# EAGLE schematic foxBMS_BMS-Slave_12cell (EAGLE 6.5.0), part 2 of 3
## Sheet 7 of 17: Passive Cell Balancing
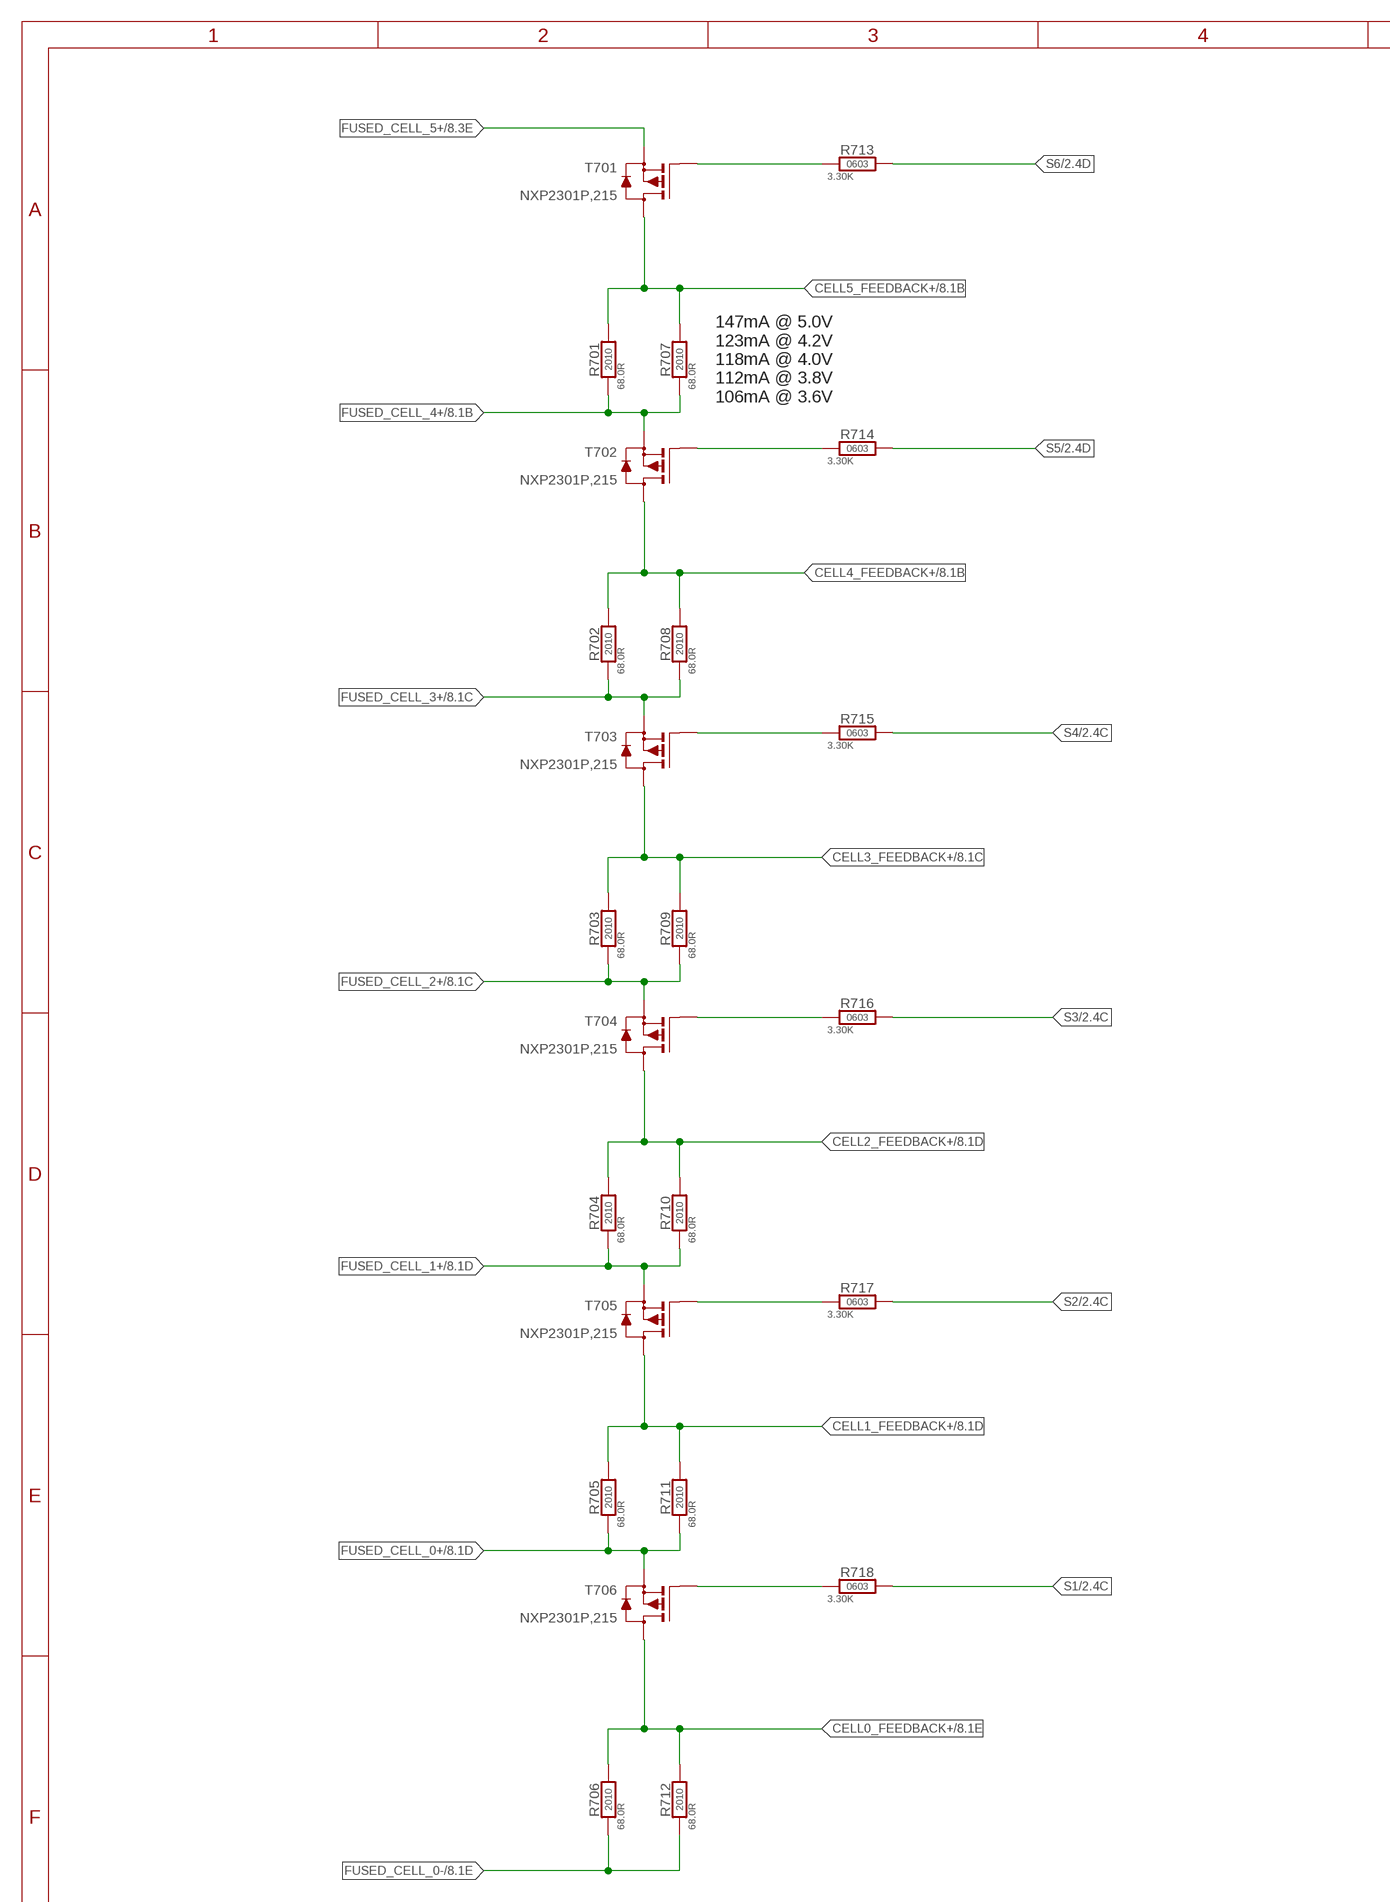
[diagram p11: schematic, sheet 7, part 1 of 2]
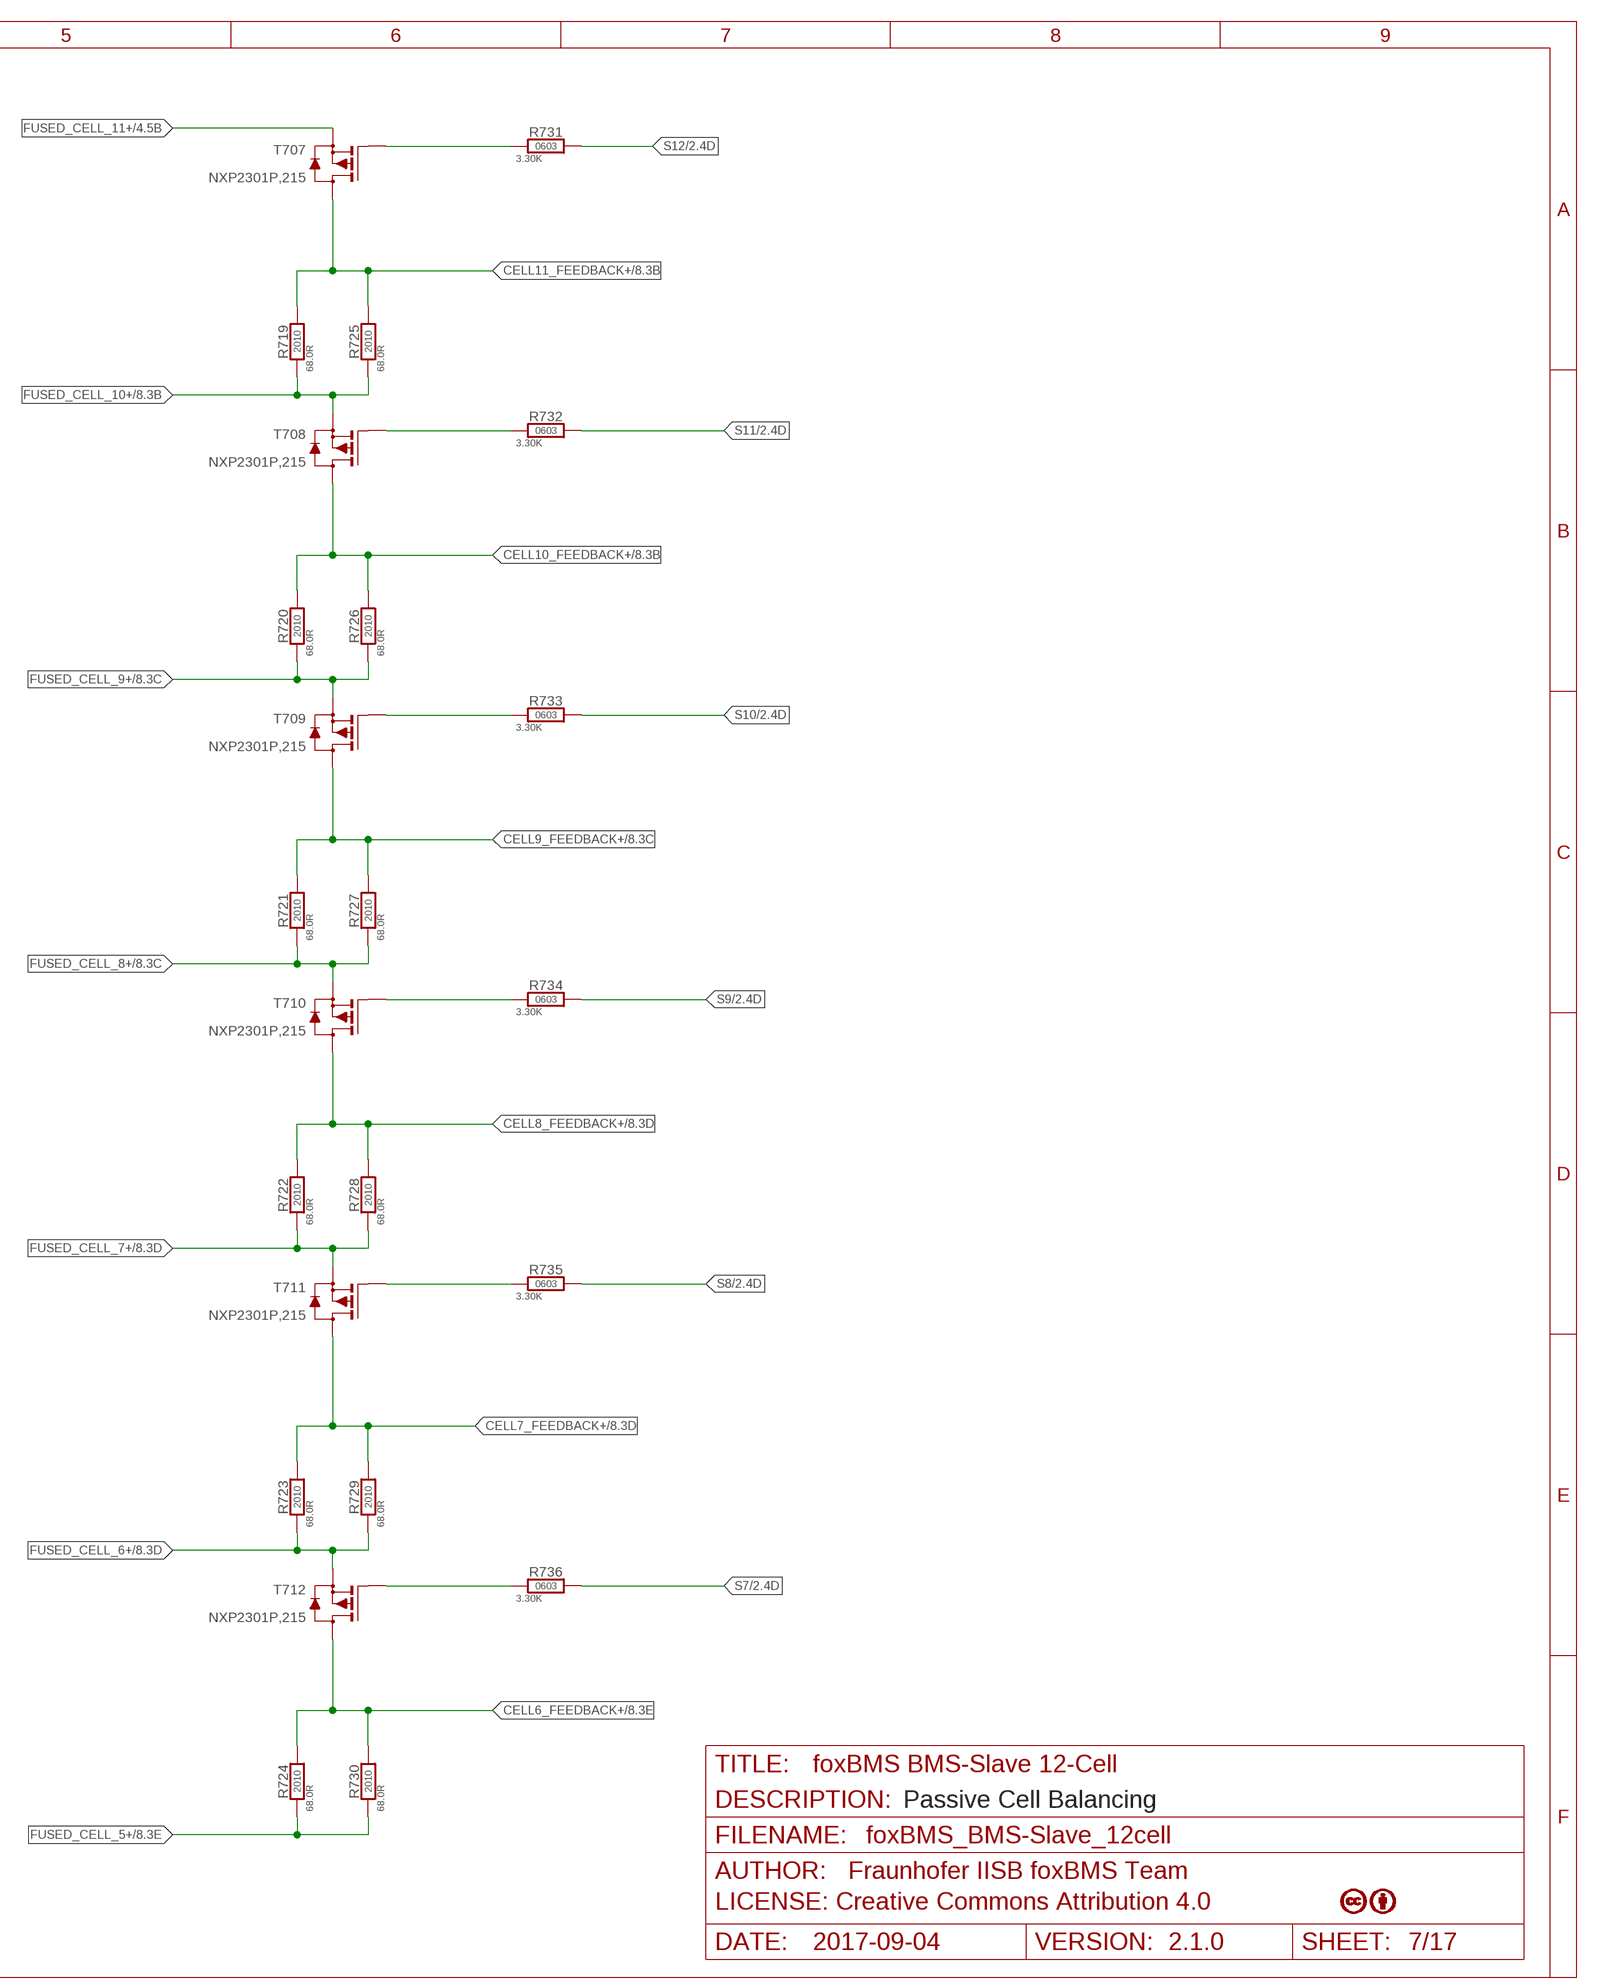
[diagram p12: schematic, sheet 7, part 2 of 2]

### Parts
R701  72R, 1%  68,0R_2010_R_YAGEO_5%_TK100_REV_01  [R_SMD_2010_R_YAGEO_REV01]  (not fitted in variant foxBMS_Debug)  (not fitted in variant foxBMS_DC-DC-only)
R702  72R, 1%  68,0R_2010_R_YAGEO_5%_TK100_REV_01  [R_SMD_2010_R_YAGEO_REV01]  (not fitted in variant foxBMS_Debug)  (not fitted in variant foxBMS_DC-DC-only)
R703  72R, 1%  68,0R_2010_R_YAGEO_5%_TK100_REV_01  [R_SMD_2010_R_YAGEO_REV01]  (not fitted in variant foxBMS_Debug)  (not fitted in variant foxBMS_DC-DC-only)
R704  72R, 1%  68,0R_2010_R_YAGEO_5%_TK100_REV_01  [R_SMD_2010_R_YAGEO_REV01]  (not fitted in variant foxBMS_Debug)  (not fitted in variant foxBMS_DC-DC-only)
R705  72R, 1%  68,0R_2010_R_YAGEO_5%_TK100_REV_01  [R_SMD_2010_R_YAGEO_REV01]  (not fitted in variant foxBMS_Debug)  (not fitted in variant foxBMS_DC-DC-only)
R706  72R, 1%  68,0R_2010_R_YAGEO_5%_TK100_REV_01  [R_SMD_2010_R_YAGEO_REV01]  (not fitted in variant foxBMS_Debug)  (not fitted in variant foxBMS_DC-DC-only)
R707  72R, 1%  68,0R_2010_R_YAGEO_5%_TK100_REV_01  [R_SMD_2010_R_YAGEO_REV01]  (not fitted in variant foxBMS_Debug)  (not fitted in variant foxBMS_DC-DC-only)
R708  72R, 1%  68,0R_2010_R_YAGEO_5%_TK100_REV_01  [R_SMD_2010_R_YAGEO_REV01]  (not fitted in variant foxBMS_Debug)  (not fitted in variant foxBMS_DC-DC-only)
R709  72R, 1%  68,0R_2010_R_YAGEO_5%_TK100_REV_01  [R_SMD_2010_R_YAGEO_REV01]  (not fitted in variant foxBMS_Debug)  (not fitted in variant foxBMS_DC-DC-only)
R710  72R, 1%  68,0R_2010_R_YAGEO_5%_TK100_REV_01  [R_SMD_2010_R_YAGEO_REV01]  (not fitted in variant foxBMS_Debug)  (not fitted in variant foxBMS_DC-DC-only)
R711  72R, 1%  68,0R_2010_R_YAGEO_5%_TK100_REV_01  [R_SMD_2010_R_YAGEO_REV01]  (not fitted in variant foxBMS_Debug)  (not fitted in variant foxBMS_DC-DC-only)
R712  72R, 1%  68,0R_2010_R_YAGEO_5%_TK100_REV_01  [R_SMD_2010_R_YAGEO_REV01]  (not fitted in variant foxBMS_Debug)  (not fitted in variant foxBMS_DC-DC-only)
R713  3.3k, 10%, 1/10W  3,30K_0603_R_VISHAY_1%_TK100_REV_01  [R_SMD_0603_R_VISHAY_REV01]  (not fitted in variant foxBMS_Debug)  (not fitted in variant foxBMS_DC-DC-only)
R714  3.3k, 10%, 1/10W  3,30K_0603_R_VISHAY_1%_TK100_REV_01  [R_SMD_0603_R_VISHAY_REV01]  (not fitted in variant foxBMS_Debug)  (not fitted in variant foxBMS_DC-DC-only)
R715  3.3k, 10%, 1/10W  3,30K_0603_R_VISHAY_1%_TK100_REV_01  [R_SMD_0603_R_VISHAY_REV01]  (not fitted in variant foxBMS_Debug)  (not fitted in variant foxBMS_DC-DC-only)
R716  3.3k, 10%, 1/10W  3,30K_0603_R_VISHAY_1%_TK100_REV_01  [R_SMD_0603_R_VISHAY_REV01]  (not fitted in variant foxBMS_Debug)  (not fitted in variant foxBMS_DC-DC-only)
R717  3.3k, 10%, 1/10W  3,30K_0603_R_VISHAY_1%_TK100_REV_01  [R_SMD_0603_R_VISHAY_REV01]  (not fitted in variant foxBMS_Debug)  (not fitted in variant foxBMS_DC-DC-only)
R718  3.3k, 10%, 1/10W  3,30K_0603_R_VISHAY_1%_TK100_REV_01  [R_SMD_0603_R_VISHAY_REV01]  (not fitted in variant foxBMS_Debug)  (not fitted in variant foxBMS_DC-DC-only)
R719  72R, 1%  68,0R_2010_R_YAGEO_5%_TK100_REV_01  [R_SMD_2010_R_YAGEO_REV01]  (not fitted in variant foxBMS_Debug)  (not fitted in variant foxBMS_DC-DC-only)
R720  72R, 1%  68,0R_2010_R_YAGEO_5%_TK100_REV_01  [R_SMD_2010_R_YAGEO_REV01]  (not fitted in variant foxBMS_Debug)  (not fitted in variant foxBMS_DC-DC-only)
R721  72R, 1%  68,0R_2010_R_YAGEO_5%_TK100_REV_01  [R_SMD_2010_R_YAGEO_REV01]  (not fitted in variant foxBMS_Debug)  (not fitted in variant foxBMS_DC-DC-only)
R722  72R, 1%  68,0R_2010_R_YAGEO_5%_TK100_REV_01  [R_SMD_2010_R_YAGEO_REV01]  (not fitted in variant foxBMS_Debug)  (not fitted in variant foxBMS_DC-DC-only)
R723  72R, 1%  68,0R_2010_R_YAGEO_5%_TK100_REV_01  [R_SMD_2010_R_YAGEO_REV01]  (not fitted in variant foxBMS_Debug)  (not fitted in variant foxBMS_DC-DC-only)
R724  72R, 1%  68,0R_2010_R_YAGEO_5%_TK100_REV_01  [R_SMD_2010_R_YAGEO_REV01]  (not fitted in variant foxBMS_Debug)  (not fitted in variant foxBMS_DC-DC-only)
R725  72R, 1%  68,0R_2010_R_YAGEO_5%_TK100_REV_01  [R_SMD_2010_R_YAGEO_REV01]  (not fitted in variant foxBMS_Debug)  (not fitted in variant foxBMS_DC-DC-only)
R726  72R, 1%  68,0R_2010_R_YAGEO_5%_TK100_REV_01  [R_SMD_2010_R_YAGEO_REV01]  (not fitted in variant foxBMS_Debug)  (not fitted in variant foxBMS_DC-DC-only)
R727  72R, 1%  68,0R_2010_R_YAGEO_5%_TK100_REV_01  [R_SMD_2010_R_YAGEO_REV01]  (not fitted in variant foxBMS_Debug)  (not fitted in variant foxBMS_DC-DC-only)
R728  72R, 1%  68,0R_2010_R_YAGEO_5%_TK100_REV_01  [R_SMD_2010_R_YAGEO_REV01]  (not fitted in variant foxBMS_Debug)  (not fitted in variant foxBMS_DC-DC-only)
R729  72R, 1%  68,0R_2010_R_YAGEO_5%_TK100_REV_01  [R_SMD_2010_R_YAGEO_REV01]  (not fitted in variant foxBMS_Debug)  (not fitted in variant foxBMS_DC-DC-only)
R730  72R, 1%  68,0R_2010_R_YAGEO_5%_TK100_REV_01  [R_SMD_2010_R_YAGEO_REV01]  (not fitted in variant foxBMS_Debug)  (not fitted in variant foxBMS_DC-DC-only)
R731  3.3k, 10%, 1/10W  3,30K_0603_R_VISHAY_1%_TK100_REV_01  [R_SMD_0603_R_VISHAY_REV01]  (not fitted in variant foxBMS_Debug)  (not fitted in variant foxBMS_DC-DC-only)
R732  3.3k, 10%, 1/10W  3,30K_0603_R_VISHAY_1%_TK100_REV_01  [R_SMD_0603_R_VISHAY_REV01]  (not fitted in variant foxBMS_Debug)  (not fitted in variant foxBMS_DC-DC-only)
R733  3.3k, 10%, 1/10W  3,30K_0603_R_VISHAY_1%_TK100_REV_01  [R_SMD_0603_R_VISHAY_REV01]  (not fitted in variant foxBMS_Debug)  (not fitted in variant foxBMS_DC-DC-only)
R734  3.3k, 10%, 1/10W  3,30K_0603_R_VISHAY_1%_TK100_REV_01  [R_SMD_0603_R_VISHAY_REV01]  (not fitted in variant foxBMS_Debug)  (not fitted in variant foxBMS_DC-DC-only)
R735  3.3k, 10%, 1/10W  3,30K_0603_R_VISHAY_1%_TK100_REV_01  [R_SMD_0603_R_VISHAY_REV01]  (not fitted in variant foxBMS_Debug)  (not fitted in variant foxBMS_DC-DC-only)
R736  3.3k, 10%, 1/10W  3,30K_0603_R_VISHAY_1%_TK100_REV_01  [R_SMD_0603_R_VISHAY_REV01]  (not fitted in variant foxBMS_Debug)  (not fitted in variant foxBMS_DC-DC-only)
T701  NX2301P  NX2301P,215  [D_SMD_SOT23_(TO-236AB)_R_NXP_REV01]  (not fitted in variant foxBMS_Debug)  (not fitted in variant foxBMS_DC-DC-only)
T702  NX2301P  NX2301P,215  [D_SMD_SOT23_(TO-236AB)_R_NXP_REV01]  (not fitted in variant foxBMS_Debug)  (not fitted in variant foxBMS_DC-DC-only)
T703  NX2301P  NX2301P,215  [D_SMD_SOT23_(TO-236AB)_R_NXP_REV01]  (not fitted in variant foxBMS_Debug)  (not fitted in variant foxBMS_DC-DC-only)
T704  NX2301P  NX2301P,215  [D_SMD_SOT23_(TO-236AB)_R_NXP_REV01]  (not fitted in variant foxBMS_Debug)  (not fitted in variant foxBMS_DC-DC-only)
T705  NX2301P  NX2301P,215  [D_SMD_SOT23_(TO-236AB)_R_NXP_REV01]  (not fitted in variant foxBMS_Debug)  (not fitted in variant foxBMS_DC-DC-only)
T706  NX2301P  NX2301P,215  [D_SMD_SOT23_(TO-236AB)_R_NXP_REV01]  (not fitted in variant foxBMS_Debug)  (not fitted in variant foxBMS_DC-DC-only)
T707  NX2301P  NX2301P,215  [D_SMD_SOT23_(TO-236AB)_R_NXP_REV01]  (not fitted in variant foxBMS_Debug)  (not fitted in variant foxBMS_DC-DC-only)
T708  NX2301P  NX2301P,215  [D_SMD_SOT23_(TO-236AB)_R_NXP_REV01]  (not fitted in variant foxBMS_Debug)  (not fitted in variant foxBMS_DC-DC-only)
T709  NX2301P  NX2301P,215  [D_SMD_SOT23_(TO-236AB)_R_NXP_REV01]  (not fitted in variant foxBMS_Debug)  (not fitted in variant foxBMS_DC-DC-only)
T710  NX2301P  NX2301P,215  [D_SMD_SOT23_(TO-236AB)_R_NXP_REV01]  (not fitted in variant foxBMS_Debug)  (not fitted in variant foxBMS_DC-DC-only)
T711  NX2301P  NX2301P,215  [D_SMD_SOT23_(TO-236AB)_R_NXP_REV01]  (not fitted in variant foxBMS_Debug)  (not fitted in variant foxBMS_DC-DC-only)
T712  NX2301P  NX2301P,215  [D_SMD_SOT23_(TO-236AB)_R_NXP_REV01]  (not fitted in variant foxBMS_Debug)  (not fitted in variant foxBMS_DC-DC-only)

### Nets
CELL0_FEEDBACK+: R706.P$2 R712.P$2 T706.3(D) ; also sheet 8
CELL1_FEEDBACK+: R705.P$2 R711.P$2 T705.3(D) ; also sheet 8
CELL2_FEEDBACK+: R704.P$2 R710.P$2 T704.3(D) ; also sheet 8
CELL3_FEEDBACK+: R703.P$2 R709.P$2 T703.3(D) ; also sheet 8
CELL4_FEEDBACK+: R702.P$2 R708.P$2 T702.3(D) ; also sheet 8
CELL5_FEEDBACK+: R701.P$2 R707.P$2 T701.3(D) ; also sheet 8
CELL6_FEEDBACK+: R724.P$2 R730.P$2 T712.3(D) ; also sheet 8
CELL7_FEEDBACK+: R723.P$2 R729.P$2 T711.3(D) ; also sheet 8
CELL8_FEEDBACK+: R722.P$2 R728.P$2 T710.3(D) ; also sheet 8
CELL9_FEEDBACK+: R721.P$2 R727.P$2 T709.3(D) ; also sheet 8
CELL10_FEEDBACK+: R720.P$2 R726.P$2 T708.3(D) ; also sheet 8
CELL11_FEEDBACK+: R719.P$2 R725.P$2 T707.3(D) ; also sheet 8
FUSED_CELL_0+: R705.P$1 R711.P$1 T706.2(S) ; also sheet 4,5,6,8
FUSED_CELL_0-: R706.P$1 R712.P$1 ; also sheet 4,5,6,8
FUSED_CELL_1+: R704.P$1 R710.P$1 T705.2(S) ; also sheet 4,5,6,8
FUSED_CELL_2+: R703.P$1 R709.P$1 T704.2(S) ; also sheet 4,5,6,8
FUSED_CELL_3+: R702.P$1 R708.P$1 T703.2(S) ; also sheet 4,5,6,8
FUSED_CELL_4+: R701.P$1 R707.P$1 T702.2(S) ; also sheet 4,5,6,8
FUSED_CELL_5+: R724.P$1 R730.P$1 T701.2(S) ; also sheet 4,5,6,8
FUSED_CELL_6+: R723.P$1 R729.P$1 T712.2(S) ; also sheet 4,5,6,8
FUSED_CELL_7+: R722.P$1 R728.P$1 T711.2(S) ; also sheet 4,5,6,8
FUSED_CELL_8+: R721.P$1 R727.P$1 T710.2(S) ; also sheet 4,5,6,8
FUSED_CELL_9+: R720.P$1 R726.P$1 T709.2(S) ; also sheet 4,5,6,8
FUSED_CELL_10+: R719.P$1 R725.P$1 T708.2(S) ; also sheet 4,5,6,8
FUSED_CELL_11+: T707.2(S) ; also sheet 4,5,6
N$32: R718.1 T706.1(G)
N$49: R717.1 T705.1(G)
N$51: R716.1 T704.1(G)
N$54: R715.1 T703.1(G)
N$57: R714.1 T702.1(G)
N$60: R713.1 T701.1(G)
N$63: R736.1 T712.1(G)
N$69: R735.1 T711.1(G)
N$72: R734.1 T710.1(G)
N$75: R733.1 T709.1(G)
N$78: R732.1 T708.1(G)
N$81: R731.1 T707.1(G)
S1: R718.2 ; also sheet 2
S2: R717.2 ; also sheet 2
S3: R716.2 ; also sheet 2
S4: R715.2 ; also sheet 2
S5: R714.2 ; also sheet 2
S6: R713.2 ; also sheet 2
S7: R736.2 ; also sheet 2
S8: R735.2 ; also sheet 2
S9: R734.2 ; also sheet 2
S10: R733.2 ; also sheet 2
S11: R732.2 ; also sheet 2
S12: R731.2 ; also sheet 2

### Notes on the sheet
- 147mA @ 5.0V
  123mA @ 4.2V
  118mA @ 4.0V
  112mA @ 3.8V
  106mA @ 3.6V
- Passive Cell Balancing

## Sheet 8 of 17: Passive Balacing Feedback
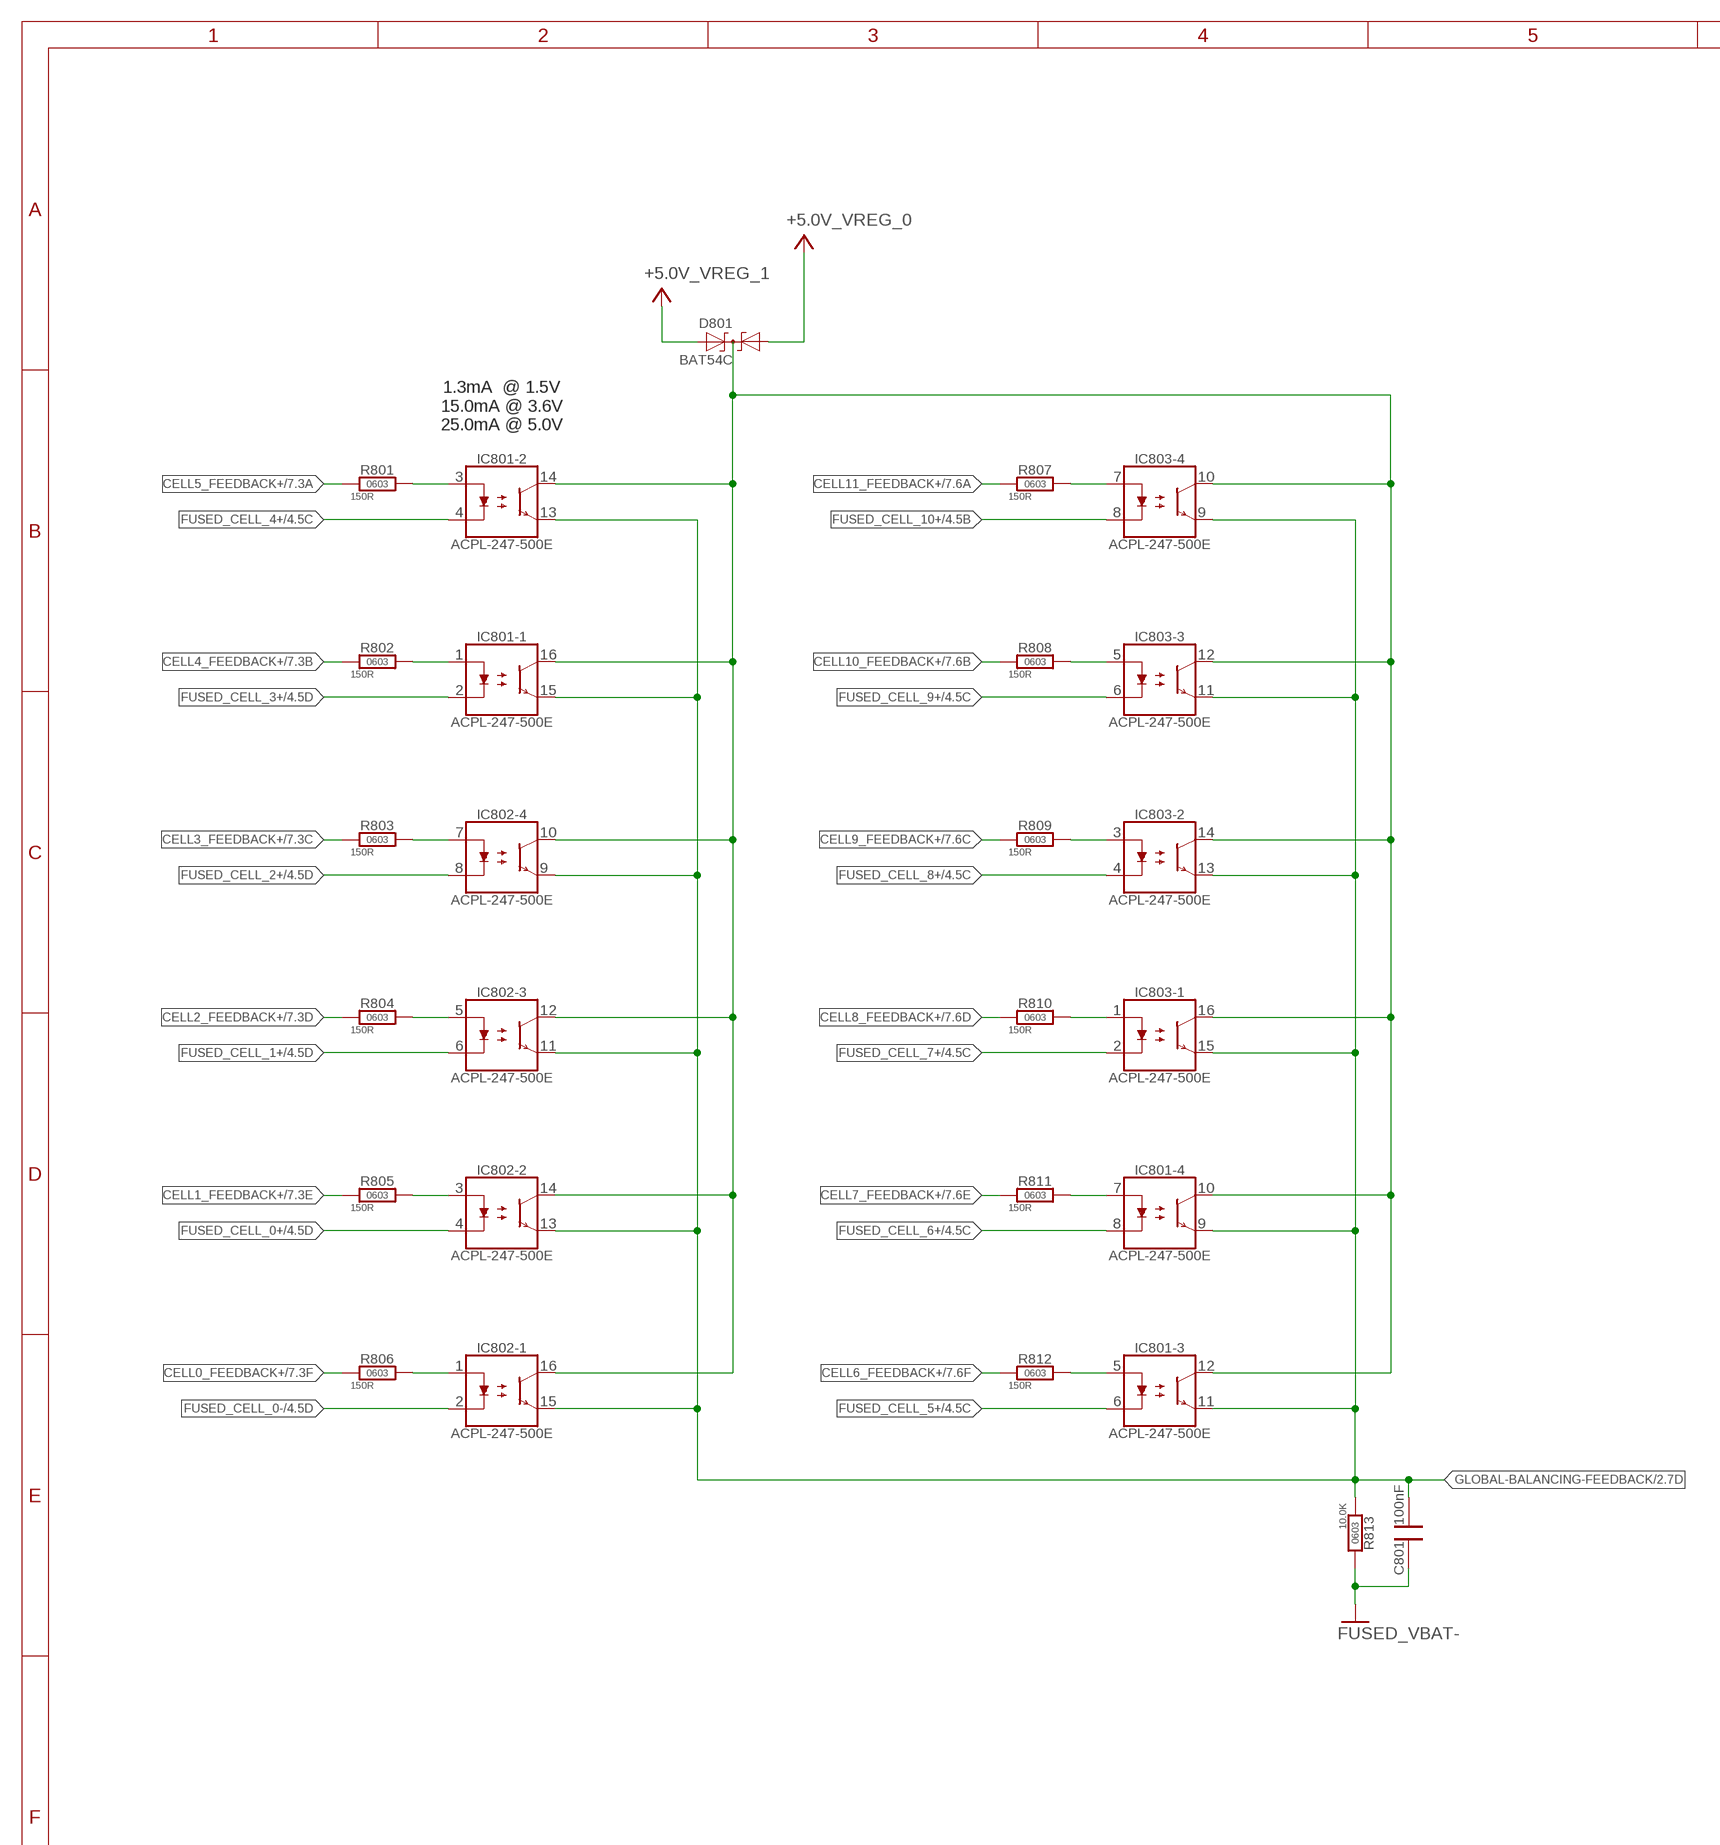
[diagram p13: schematic, sheet 8, part 1 of 2]
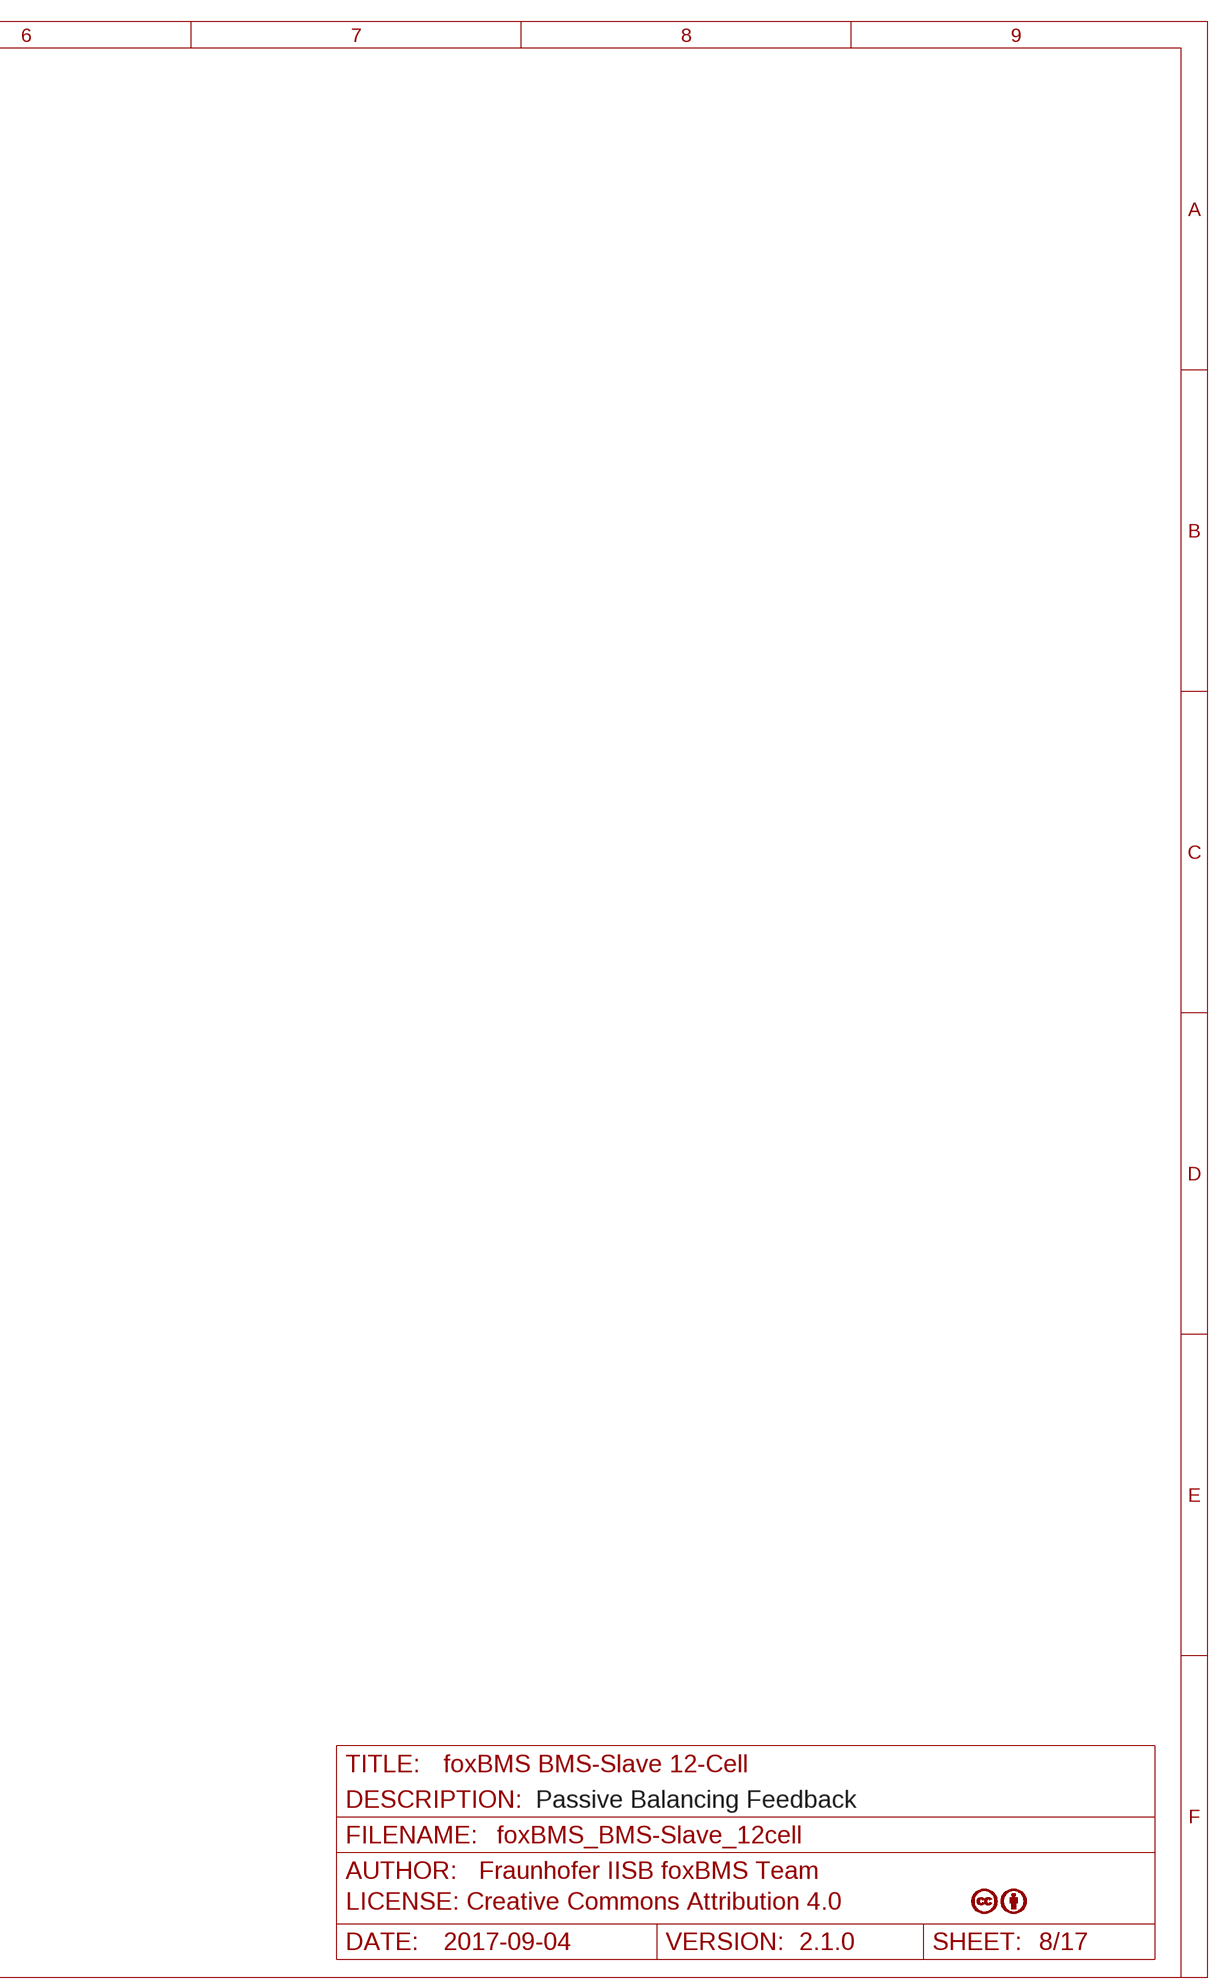
[diagram p14: schematic, sheet 8, part 2 of 2]

### Parts
C801  100nF, 20%, 16V  100NF_0603_16V_X7R_KEMET  [C_SMD_0603_(1608)_R_KEMET_REV01]  (not fitted in variant foxBMS_Debug)  (not fitted in variant foxBMS_DC-DC-only)
D801  BAT54C  [D_SMD_SOT23_(TO-236AB)_R_NXP_REV01]  (not fitted in variant foxBMS_Debug)  (not fitted in variant foxBMS_DC-DC-only)
IC801  ACPL-247-500E  [OC_SMD_SOIC-16_R_AVAGO_REV01]  (not fitted in variant foxBMS_Debug)  (not fitted in variant foxBMS_DC-DC-only)
IC802  ACPL-247-500E  [OC_SMD_SOIC-16_R_AVAGO_REV01]  (not fitted in variant foxBMS_Debug)  (not fitted in variant foxBMS_DC-DC-only)
IC803  ACPL-247-500E  [OC_SMD_SOIC-16_R_AVAGO_REV01]  (not fitted in variant foxBMS_Debug)  (not fitted in variant foxBMS_DC-DC-only)
R801  150R_0603_R_VISHAY_1%_TK100_REV_01  [R_SMD_0603_R_VISHAY_REV01]  (not fitted in variant foxBMS_Debug)  (not fitted in variant foxBMS_DC-DC-only)
R802  150R_0603_R_VISHAY_1%_TK100_REV_01  [R_SMD_0603_R_VISHAY_REV01]  (not fitted in variant foxBMS_Debug)  (not fitted in variant foxBMS_DC-DC-only)
R803  150R_0603_R_VISHAY_1%_TK100_REV_01  [R_SMD_0603_R_VISHAY_REV01]  (not fitted in variant foxBMS_Debug)  (not fitted in variant foxBMS_DC-DC-only)
R804  150R_0603_R_VISHAY_1%_TK100_REV_01  [R_SMD_0603_R_VISHAY_REV01]  (not fitted in variant foxBMS_Debug)  (not fitted in variant foxBMS_DC-DC-only)
R805  150R_0603_R_VISHAY_1%_TK100_REV_01  [R_SMD_0603_R_VISHAY_REV01]  (not fitted in variant foxBMS_Debug)  (not fitted in variant foxBMS_DC-DC-only)
R806  150R_0603_R_VISHAY_1%_TK100_REV_01  [R_SMD_0603_R_VISHAY_REV01]  (not fitted in variant foxBMS_Debug)  (not fitted in variant foxBMS_DC-DC-only)
R807  150R_0603_R_VISHAY_1%_TK100_REV_01  [R_SMD_0603_R_VISHAY_REV01]  (not fitted in variant foxBMS_Debug)  (not fitted in variant foxBMS_DC-DC-only)
R808  150R_0603_R_VISHAY_1%_TK100_REV_01  [R_SMD_0603_R_VISHAY_REV01]  (not fitted in variant foxBMS_Debug)  (not fitted in variant foxBMS_DC-DC-only)
R809  150R_0603_R_VISHAY_1%_TK100_REV_01  [R_SMD_0603_R_VISHAY_REV01]  (not fitted in variant foxBMS_Debug)  (not fitted in variant foxBMS_DC-DC-only)
R810  150R_0603_R_VISHAY_1%_TK100_REV_01  [R_SMD_0603_R_VISHAY_REV01]  (not fitted in variant foxBMS_Debug)  (not fitted in variant foxBMS_DC-DC-only)
R811  150R_0603_R_VISHAY_1%_TK100_REV_01  [R_SMD_0603_R_VISHAY_REV01]  (not fitted in variant foxBMS_Debug)  (not fitted in variant foxBMS_DC-DC-only)
R812  150R_0603_R_VISHAY_1%_TK100_REV_01  [R_SMD_0603_R_VISHAY_REV01]  (not fitted in variant foxBMS_Debug)  (not fitted in variant foxBMS_DC-DC-only)
R813  10,0K_0603_R_VISHAY_1%_TK100_REV_01  [R_SMD_0603_R_VISHAY_REV01]  (not fitted in variant foxBMS_Debug)  (not fitted in variant foxBMS_DC-DC-only)

### Nets
+5.0V_VREG_0: D801.2(A2) ; also sheet 2,9,11,13,15
+5.0V_VREG_1: D801.1(A1) ; also sheet 3,10,12,14,15
CELL0_FEEDBACK+: R806.1 ; also sheet 7
CELL1_FEEDBACK+: R805.1 ; also sheet 7
CELL2_FEEDBACK+: R804.1 ; also sheet 7
CELL3_FEEDBACK+: R803.1 ; also sheet 7
CELL4_FEEDBACK+: R802.1 ; also sheet 7
CELL5_FEEDBACK+: R801.1 ; also sheet 7
CELL6_FEEDBACK+: R812.1 ; also sheet 7
CELL7_FEEDBACK+: R811.1 ; also sheet 7
CELL8_FEEDBACK+: R810.1 ; also sheet 7
CELL9_FEEDBACK+: R809.1 ; also sheet 7
CELL10_FEEDBACK+: R808.1 ; also sheet 7
CELL11_FEEDBACK+: R807.1 ; also sheet 7
FUSED_CELL_0+: IC802.4(-2:K) ; also sheet 4,5,6,7
FUSED_CELL_0-: IC802.2(-1:K) ; also sheet 4,5,6,7
FUSED_CELL_1+: IC802.6(-3:K) ; also sheet 4,5,6,7
FUSED_CELL_2+: IC802.8(-4:K) ; also sheet 4,5,6,7
FUSED_CELL_3+: IC801.2(-1:K) ; also sheet 4,5,6,7
FUSED_CELL_4+: IC801.4(-2:K) ; also sheet 4,5,6,7
FUSED_CELL_5+: IC801.6(-3:K) ; also sheet 4,5,6,7
FUSED_CELL_6+: IC801.8(-4:K) ; also sheet 4,5,6,7
FUSED_CELL_7+: IC803.2(-1:K) ; also sheet 4,5,6,7
FUSED_CELL_8+: IC803.4(-2:K) ; also sheet 4,5,6,7
FUSED_CELL_9+: IC803.6(-3:K) ; also sheet 4,5,6,7
FUSED_CELL_10+: IC803.8(-4:K) ; also sheet 4,5,6,7
FUSED_VBAT-: C801.1 R813.2 ; also sheet 2,3,4,5,6,9,10,11,12,13,14,15,16
GLOBAL-BALANCING-FEEDBACK: C801.2 IC801.9(-4:V_EMITTER) IC801.11(-3:V_EMITTER) IC801.13(-2:V_EMITTER) IC801.15(-1:V_EMITTER) IC802.9(-4:V_EMITTER) IC802.11(-3:V_EMITTER) IC802.13(-2:V_EMITTER) IC802.15(-1:V_EMITTER) IC803.9(-4:V_EMITTER) IC803.11(-3:V_EMITTER) IC803.13(-2:V_EMITTER) IC803.15(-1:V_EMITTER) R813.1 ; also sheet 2,3
N$39: D801.3(C) IC801.10(-4:V_COLLECTOR) IC801.12(-3:V_COLLECTOR) IC801.14(-2:V_COLLECTOR) IC801.16(-1:V_COLLECTOR) IC802.10(-4:V_COLLECTOR) IC802.12(-3:V_COLLECTOR) IC802.14(-2:V_COLLECTOR) IC802.16(-1:V_COLLECTOR) IC803.10(-4:V_COLLECTOR) IC803.12(-3:V_COLLECTOR) IC803.14(-2:V_COLLECTOR) IC803.16(-1:V_COLLECTOR)
N$52: IC801.1(-1:A) R802.2
N$55: IC802.7(-4:A) R803.2
N$58: IC802.5(-3:A) R804.2
N$61: IC803.5(-3:A) R808.2
N$64: IC803.3(-2:A) R809.2
N$70: IC802.3(-2:A) R805.2
N$73: IC803.7(-4:A) R807.2
N$83: IC803.1(-1:A) R810.2
N$85: IC801.7(-4:A) R811.2
N$88: IC802.1(-1:A) R806.2
N$90: IC801.5(-3:A) R812.2
N$93: IC801.3(-2:A) R801.2

### Notes on the sheet
- 1.3mA  @ 1.5V
  15.0mA @ 3.6V
  25.0mA @ 5.0V
- Passive Balancing Feedback

## Sheet 9 of 17: Primary Analog Inputs
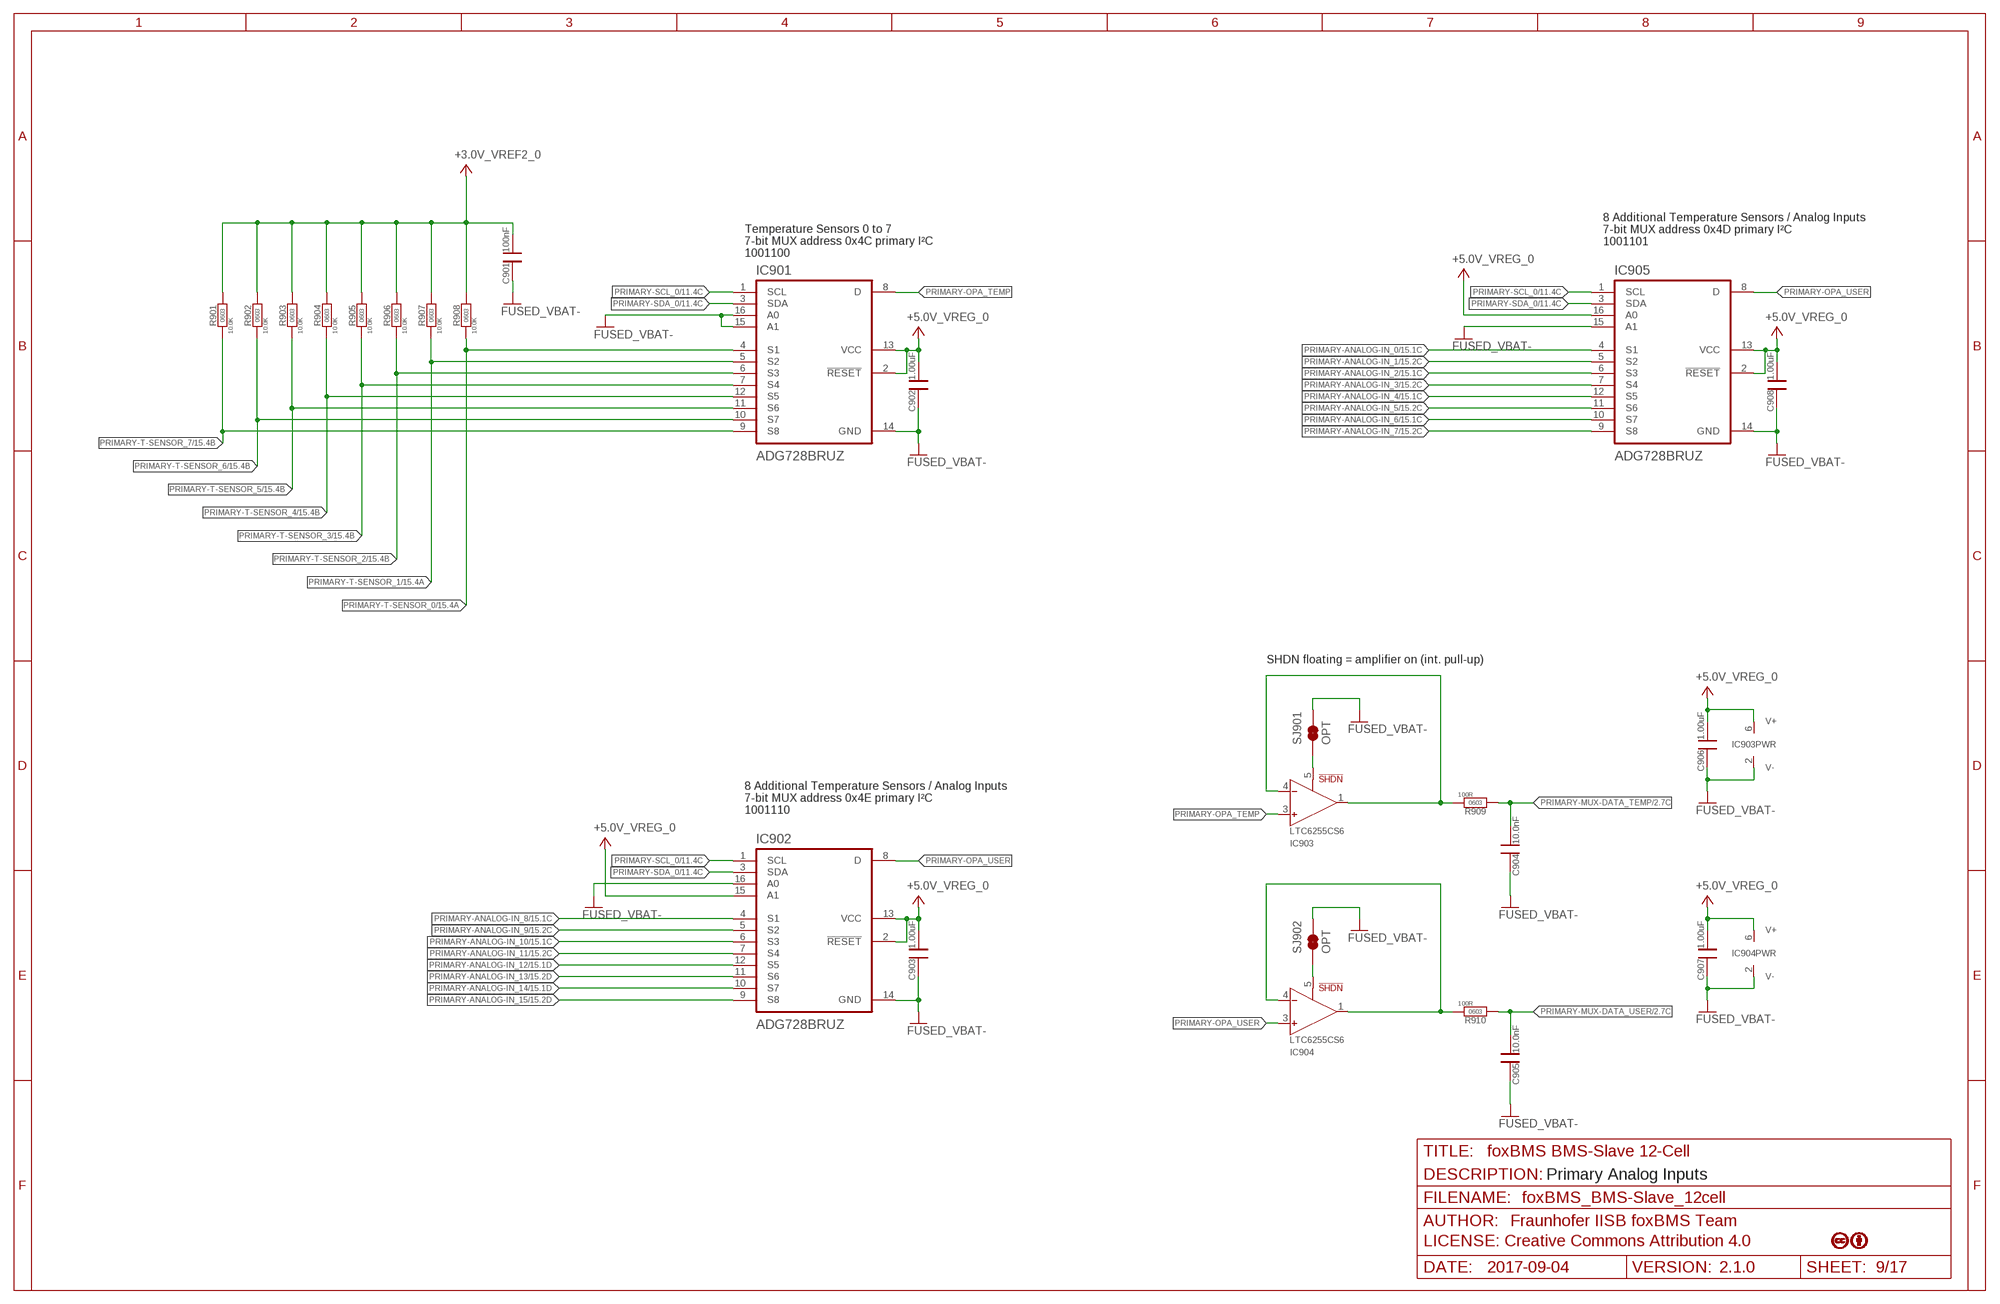
[diagram p15: schematic, sheet 9]

### Parts
C901  100nF, 20%, 16V  100NF_0603_16V_X7R_KEMET  [C_SMD_0603_(1608)_R_KEMET_REV01]  (not fitted in variant foxBMS_Debug)  (not fitted in variant foxBMS_DC-DC-only)
C902  1uF, 20%, 16V  1,00µF_0603_16V_X7R_KEMET  [C_SMD_0603_(1608)_R_KEMET_REV01]  (not fitted in variant foxBMS_Debug)  (not fitted in variant foxBMS_DC-DC-only)
C903  1uF, 20%, 16V  1,00µF_0603_16V_X7R_KEMET  [C_SMD_0603_(1608)_R_KEMET_REV01]  (not fitted in variant foxBMS_Debug)  (not fitted in variant foxBMS_DC-DC-only)
C904  10nF, 100V, 10%  10,0NF_0603__100V_X7R_KEMET  [C_SMD_0603_(1608)_R_KEMET_REV01]  (not fitted in variant foxBMS_Debug)  (not fitted in variant foxBMS_DC-DC-only)
C905  10nF, 100V, 10%  10,0NF_0603__100V_X7R_KEMET  [C_SMD_0603_(1608)_R_KEMET_REV01]  (not fitted in variant foxBMS_Debug)  (not fitted in variant foxBMS_DC-DC-only)
C906  1uF, 20%, 16V  1,00µF_0603_16V_X7R_KEMET  [C_SMD_0603_(1608)_R_KEMET_REV01]  (not fitted in variant foxBMS_Debug)  (not fitted in variant foxBMS_DC-DC-only)
C907  1uF, 20%, 16V  1,00µF_0603_16V_X7R_KEMET  [C_SMD_0603_(1608)_R_KEMET_REV01]  (not fitted in variant foxBMS_Debug)  (not fitted in variant foxBMS_DC-DC-only)
C908  1uF, 20%, 16V  1,00µF_0603_16V_X7R_KEMET  [C_SMD_0603_(1608)_R_KEMET_REV01]  (not fitted in variant foxBMS_Debug)  (not fitted in variant foxBMS_DC-DC-only)
IC901  ADG728BRUZ  [SOP65P638X110-16N]  (not fitted in variant foxBMS_Debug)  (not fitted in variant foxBMS_DC-DC-only)
IC902  ADG728BRUZ  [SOP65P638X110-16N]  (not fitted in variant foxBMS_Debug)  (not fitted in variant foxBMS_DC-DC-only)
IC903  LTC6255CS6  [IC_SMD_TSOT-23-6_(S6)_R_LINEAR_REV01]  (not fitted in variant foxBMS_Debug)  (not fitted in variant foxBMS_DC-DC-only)
IC904  LTC6255CS6  [IC_SMD_TSOT-23-6_(S6)_R_LINEAR_REV01]  (not fitted in variant foxBMS_Debug)  (not fitted in variant foxBMS_DC-DC-only)
IC905  ADG728BRUZ  [SOP65P638X110-16N]  (not fitted in variant foxBMS_Debug)  (not fitted in variant foxBMS_DC-DC-only)
R901  10,0K_0603_R_VISHAY_1%_TK100_REV_01  [R_SMD_0603_R_VISHAY_REV01]  (not fitted in variant foxBMS_Debug)  (not fitted in variant foxBMS_DC-DC-only)
R902  10,0K_0603_R_VISHAY_1%_TK100_REV_01  [R_SMD_0603_R_VISHAY_REV01]  (not fitted in variant foxBMS_Debug)  (not fitted in variant foxBMS_DC-DC-only)
R903  10,0K_0603_R_VISHAY_1%_TK100_REV_01  [R_SMD_0603_R_VISHAY_REV01]  (not fitted in variant foxBMS_Debug)  (not fitted in variant foxBMS_DC-DC-only)
R904  10,0K_0603_R_VISHAY_1%_TK100_REV_01  [R_SMD_0603_R_VISHAY_REV01]  (not fitted in variant foxBMS_Debug)  (not fitted in variant foxBMS_DC-DC-only)
R905  10,0K_0603_R_VISHAY_1%_TK100_REV_01  [R_SMD_0603_R_VISHAY_REV01]  (not fitted in variant foxBMS_Debug)  (not fitted in variant foxBMS_DC-DC-only)
R906  10,0K_0603_R_VISHAY_1%_TK100_REV_01  [R_SMD_0603_R_VISHAY_REV01]  (not fitted in variant foxBMS_Debug)  (not fitted in variant foxBMS_DC-DC-only)
R907  10,0K_0603_R_VISHAY_1%_TK100_REV_01  [R_SMD_0603_R_VISHAY_REV01]  (not fitted in variant foxBMS_Debug)  (not fitted in variant foxBMS_DC-DC-only)
R908  10,0K_0603_R_VISHAY_1%_TK100_REV_01  [R_SMD_0603_R_VISHAY_REV01]  (not fitted in variant foxBMS_Debug)  (not fitted in variant foxBMS_DC-DC-only)
R909  100R_0603_R_VISHAY_1%_TK100_REV_01  [R_SMD_0603_R_VISHAY_REV01]  (not fitted in variant foxBMS_Debug)  (not fitted in variant foxBMS_DC-DC-only)
R910  100R_0603_R_VISHAY_1%_TK100_REV_01  [R_SMD_0603_R_VISHAY_REV01]  (not fitted in variant foxBMS_Debug)  (not fitted in variant foxBMS_DC-DC-only)
SJ901  OPT  CUSTOM_JUMPER_SJ  [CUSTOM_JUMPER_SJ]  (not fitted in variant foxBMS_Debug)  (not fitted in variant foxBMS_DC-DC-only)
SJ902  OPT  CUSTOM_JUMPER_SJ  [CUSTOM_JUMPER_SJ]  (not fitted in variant foxBMS_Debug)  (not fitted in variant foxBMS_DC-DC-only)

### Nets
+3.0V_VREF2_0: C901.2 R901.2 R902.2 R903.2 R904.2 R905.2 R906.2 R907.2 R908.2 ; also sheet 2,15
+5.0V_VREG_0: C902.2 C903.2 C906.2 C907.2 C908.2 IC901.2(!RESET) IC901.13(VCC) IC902.2(!RESET) IC902.13(VCC) IC902.15(A1) IC903.6(V+) IC904.6(V+) IC905.2(!RESET) IC905.13(VCC) IC905.16(A0) ; also sheet 2,8,11,13,15
FUSED_VBAT-: C901.1 C902.1 C903.1 C904.1 C905.1 C906.1 C907.1 C908.1 IC901.14(GND) IC901.15(A1) IC901.16(A0) IC902.14(GND) IC902.16(A0) IC903.2(V-) IC904.2(V-) IC905.14(GND) IC905.15(A1) SJ901.2 SJ902.2 ; also sheet 2,3,4,5,6,8,10,11,12,13,14,15,16
N$1: IC904.1(VOUT) IC904.4(-) R910.1
N$2: IC904.5(!SHDN) SJ902.1
N$6: IC903.1(VOUT) IC903.4(-) R909.1
N$16: IC903.5(!SHDN) SJ901.1
PRIMARY-ANALOG-IN_0: IC905.4(S1) ; also sheet 15
PRIMARY-ANALOG-IN_1: IC905.5(S2) ; also sheet 15
PRIMARY-ANALOG-IN_2: IC905.6(S3) ; also sheet 15
PRIMARY-ANALOG-IN_3: IC905.7(S4) ; also sheet 15
PRIMARY-ANALOG-IN_4: IC905.12(S5) ; also sheet 15
PRIMARY-ANALOG-IN_5: IC905.11(S6) ; also sheet 15
PRIMARY-ANALOG-IN_6: IC905.10(S7) ; also sheet 15
PRIMARY-ANALOG-IN_7: IC905.9(S8) ; also sheet 15
PRIMARY-ANALOG-IN_8: IC902.4(S1) ; also sheet 15
PRIMARY-ANALOG-IN_9: IC902.5(S2) ; also sheet 15
PRIMARY-ANALOG-IN_10: IC902.6(S3) ; also sheet 15
PRIMARY-ANALOG-IN_11: IC902.7(S4) ; also sheet 15
PRIMARY-ANALOG-IN_12: IC902.12(S5) ; also sheet 15
PRIMARY-ANALOG-IN_13: IC902.11(S6) ; also sheet 15
PRIMARY-ANALOG-IN_14: IC902.10(S7) ; also sheet 15
PRIMARY-ANALOG-IN_15: IC902.9(S8) ; also sheet 15
PRIMARY-MUX-DATA_TEMP: C904.2 R909.2 ; also sheet 2
PRIMARY-MUX-DATA_USER: C905.2 R910.2 ; also sheet 2
PRIMARY-OPA_TEMP: IC901.8(D) IC903.3(+)
PRIMARY-OPA_USER: IC902.8(D) IC904.3(+) IC905.8(D)
PRIMARY-SCL_0: IC901.1(SCL) IC902.1(SCL) IC905.1(SCL) ; also sheet 2,11,13
PRIMARY-SDA_0: IC901.3(SDA) IC902.3(SDA) IC905.3(SDA) ; also sheet 2,11,13
PRIMARY-T-SENSOR_0: IC901.4(S1) R908.1 ; also sheet 15
PRIMARY-T-SENSOR_1: IC901.5(S2) R907.1 ; also sheet 15
PRIMARY-T-SENSOR_2: IC901.6(S3) R906.1 ; also sheet 15
PRIMARY-T-SENSOR_3: IC901.7(S4) R905.1 ; also sheet 15
PRIMARY-T-SENSOR_4: IC901.12(S5) R904.1 ; also sheet 15
PRIMARY-T-SENSOR_5: IC901.11(S6) R903.1 ; also sheet 15
PRIMARY-T-SENSOR_6: IC901.10(S7) R902.1 ; also sheet 15
PRIMARY-T-SENSOR_7: IC901.9(S8) R901.1 ; also sheet 15

### Notes on the sheet
- 8 Additional Temperature Sensors / Analog Inputs
  7-bit MUX address 0x4D primary I²C
  1001101
- Temperature Sensors 0 to 7
  7-bit MUX address 0x4C primary I²C
  1001100
- SHDN floating = amplifier on (int. pull-up)
- 8 Additional Temperature Sensors / Analog Inputs
  7-bit MUX address 0x4E primary I²C
  1001110
- Primary Analog Inputs

## Sheet 10 of 17: Secondary Analog Inputs
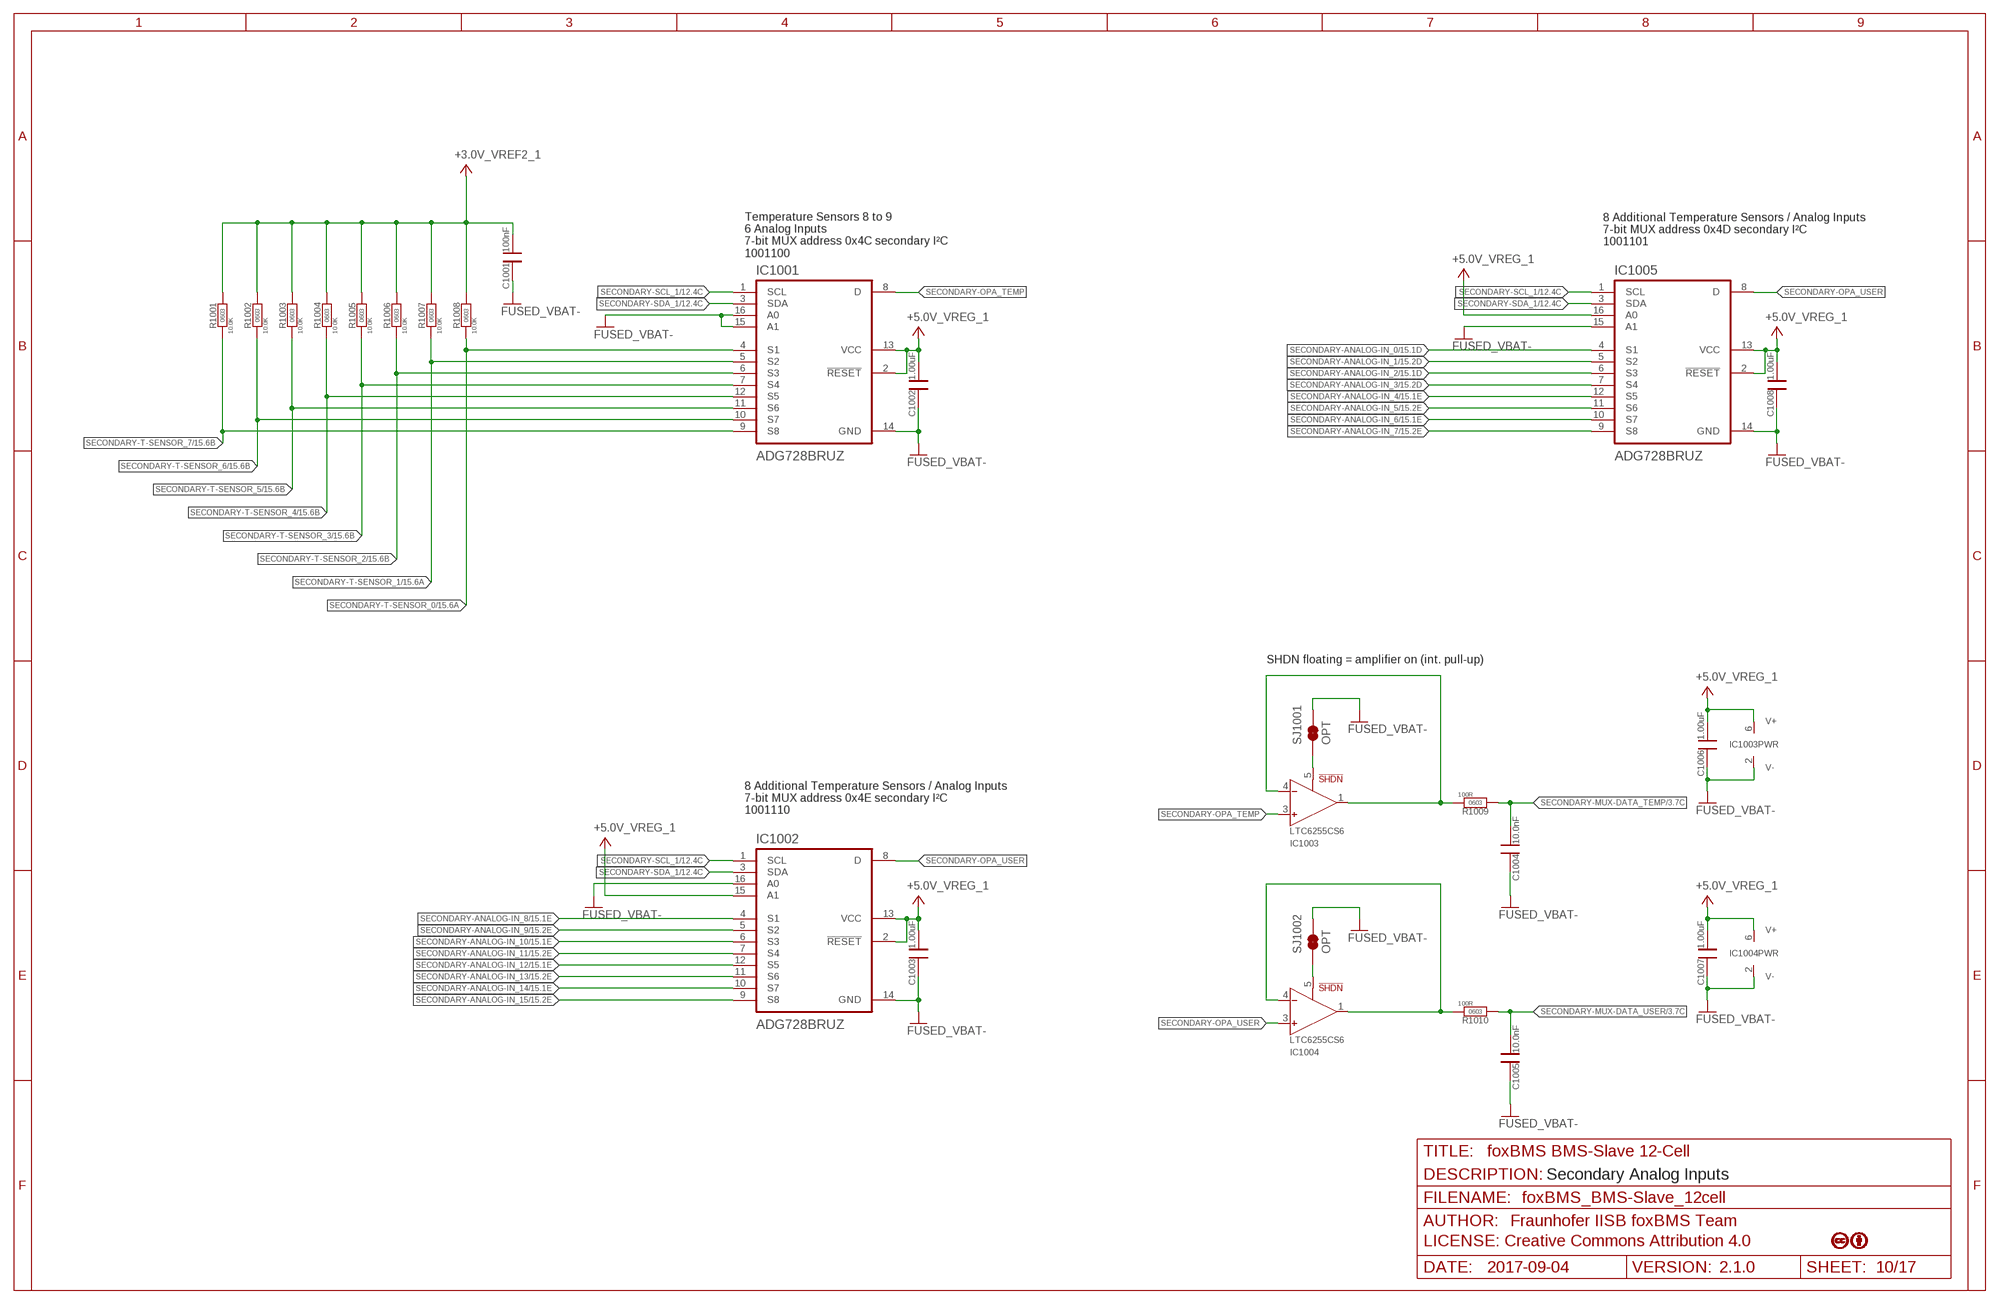
[diagram p16: schematic, sheet 10]

### Parts
C1001  100nF, 20%, 16V  100NF_0603_16V_X7R_KEMET  [C_SMD_0603_(1608)_R_KEMET_REV01]  (not fitted in variant foxBMS_Debug)  (not fitted in variant foxBMS_DC-DC-only)
C1002  1uF, 20%, 16V  1,00µF_0603_16V_X7R_KEMET  [C_SMD_0603_(1608)_R_KEMET_REV01]  (not fitted in variant foxBMS_Debug)  (not fitted in variant foxBMS_DC-DC-only)
C1003  1uF, 20%, 16V  1,00µF_0603_16V_X7R_KEMET  [C_SMD_0603_(1608)_R_KEMET_REV01]  (not fitted in variant foxBMS_Debug)  (not fitted in variant foxBMS_DC-DC-only)
C1004  10nF, 100V, 10%  10,0NF_0603__100V_X7R_KEMET  [C_SMD_0603_(1608)_R_KEMET_REV01]  (not fitted in variant foxBMS_Debug)  (not fitted in variant foxBMS_DC-DC-only)
C1005  10nF, 100V, 10%  10,0NF_0603__100V_X7R_KEMET  [C_SMD_0603_(1608)_R_KEMET_REV01]  (not fitted in variant foxBMS_Debug)  (not fitted in variant foxBMS_DC-DC-only)
C1006  1uF, 20%, 16V  1,00µF_0603_16V_X7R_KEMET  [C_SMD_0603_(1608)_R_KEMET_REV01]  (not fitted in variant foxBMS_Debug)  (not fitted in variant foxBMS_DC-DC-only)
C1007  1uF, 20%, 16V  1,00µF_0603_16V_X7R_KEMET  [C_SMD_0603_(1608)_R_KEMET_REV01]  (not fitted in variant foxBMS_Debug)  (not fitted in variant foxBMS_DC-DC-only)
C1008  1uF, 20%, 16V  1,00µF_0603_16V_X7R_KEMET  [C_SMD_0603_(1608)_R_KEMET_REV01]  (not fitted in variant foxBMS_Debug)  (not fitted in variant foxBMS_DC-DC-only)
IC1001  ADG728BRUZ  [SOP65P638X110-16N]  (not fitted in variant foxBMS_Debug)  (not fitted in variant foxBMS_DC-DC-only)
IC1002  ADG728BRUZ  [SOP65P638X110-16N]  (not fitted in variant foxBMS_Debug)  (not fitted in variant foxBMS_DC-DC-only)
IC1003  LTC6255CS6  [IC_SMD_TSOT-23-6_(S6)_R_LINEAR_REV01]  (not fitted in variant foxBMS_Debug)  (not fitted in variant foxBMS_DC-DC-only)
IC1004  LTC6255CS6  [IC_SMD_TSOT-23-6_(S6)_R_LINEAR_REV01]  (not fitted in variant foxBMS_Debug)  (not fitted in variant foxBMS_DC-DC-only)
IC1005  ADG728BRUZ  [SOP65P638X110-16N]  (not fitted in variant foxBMS_Debug)  (not fitted in variant foxBMS_DC-DC-only)
R1001  10,0K_0603_R_VISHAY_1%_TK100_REV_01  [R_SMD_0603_R_VISHAY_REV01]  (not fitted in variant foxBMS_Debug)  (not fitted in variant foxBMS_DC-DC-only)
R1002  10,0K_0603_R_VISHAY_1%_TK100_REV_01  [R_SMD_0603_R_VISHAY_REV01]  (not fitted in variant foxBMS_Debug)  (not fitted in variant foxBMS_DC-DC-only)
R1003  10,0K_0603_R_VISHAY_1%_TK100_REV_01  [R_SMD_0603_R_VISHAY_REV01]  (not fitted in variant foxBMS_Debug)  (not fitted in variant foxBMS_DC-DC-only)
R1004  10,0K_0603_R_VISHAY_1%_TK100_REV_01  [R_SMD_0603_R_VISHAY_REV01]  (not fitted in variant foxBMS_Debug)  (not fitted in variant foxBMS_DC-DC-only)
R1005  10,0K_0603_R_VISHAY_1%_TK100_REV_01  [R_SMD_0603_R_VISHAY_REV01]  (not fitted in variant foxBMS_Debug)  (not fitted in variant foxBMS_DC-DC-only)
R1006  10,0K_0603_R_VISHAY_1%_TK100_REV_01  [R_SMD_0603_R_VISHAY_REV01]  (not fitted in variant foxBMS_Debug)  (not fitted in variant foxBMS_DC-DC-only)
R1007  10,0K_0603_R_VISHAY_1%_TK100_REV_01  [R_SMD_0603_R_VISHAY_REV01]  (not fitted in variant foxBMS_Debug)  (not fitted in variant foxBMS_DC-DC-only)
R1008  10,0K_0603_R_VISHAY_1%_TK100_REV_01  [R_SMD_0603_R_VISHAY_REV01]  (not fitted in variant foxBMS_Debug)  (not fitted in variant foxBMS_DC-DC-only)
R1009  100R_0603_R_VISHAY_1%_TK100_REV_01  [R_SMD_0603_R_VISHAY_REV01]  (not fitted in variant foxBMS_Debug)  (not fitted in variant foxBMS_DC-DC-only)
R1010  100R_0603_R_VISHAY_1%_TK100_REV_01  [R_SMD_0603_R_VISHAY_REV01]  (not fitted in variant foxBMS_Debug)  (not fitted in variant foxBMS_DC-DC-only)
SJ1001  OPT  CUSTOM_JUMPER_SJ  [CUSTOM_JUMPER_SJ]  (not fitted in variant foxBMS_Debug)  (not fitted in variant foxBMS_DC-DC-only)
SJ1002  OPT  CUSTOM_JUMPER_SJ  [CUSTOM_JUMPER_SJ]  (not fitted in variant foxBMS_Debug)  (not fitted in variant foxBMS_DC-DC-only)

### Nets
+3.0V_VREF2_1: C1001.2 R1001.2 R1002.2 R1003.2 R1004.2 R1005.2 R1006.2 R1007.2 R1008.2 ; also sheet 3,15
+5.0V_VREG_1: C1002.2 C1003.2 C1006.2 C1007.2 C1008.2 IC1001.2(!RESET) IC1001.13(VCC) IC1002.2(!RESET) IC1002.13(VCC) IC1002.15(A1) IC1003.6(V+) IC1004.6(V+) IC1005.2(!RESET) IC1005.13(VCC) IC1005.16(A0) ; also sheet 3,8,12,14,15
FUSED_VBAT-: C1001.1 C1002.1 C1003.1 C1004.1 C1005.1 C1006.1 C1007.1 C1008.1 IC1001.14(GND) IC1001.15(A1) IC1001.16(A0) IC1002.14(GND) IC1002.16(A0) IC1003.2(V-) IC1004.2(V-) IC1005.14(GND) IC1005.15(A1) SJ1001.2 SJ1002.2 ; also sheet 2,3,4,5,6,8,9,11,12,13,14,15,16
N$18: IC1003.1(VOUT) IC1003.4(-) R1009.1
N$35: IC1003.5(!SHDN) SJ1001.1
N$36: IC1004.1(VOUT) IC1004.4(-) R1010.1
N$37: IC1004.5(!SHDN) SJ1002.1
SECONDARY-ANALOG-IN_0: IC1005.4(S1) ; also sheet 15
SECONDARY-ANALOG-IN_1: IC1005.5(S2) ; also sheet 15
SECONDARY-ANALOG-IN_2: IC1005.6(S3) ; also sheet 15
SECONDARY-ANALOG-IN_3: IC1005.7(S4) ; also sheet 15
SECONDARY-ANALOG-IN_4: IC1005.12(S5) ; also sheet 15
SECONDARY-ANALOG-IN_5: IC1005.11(S6) ; also sheet 15
SECONDARY-ANALOG-IN_6: IC1005.10(S7) ; also sheet 15
SECONDARY-ANALOG-IN_7: IC1005.9(S8) ; also sheet 15
SECONDARY-ANALOG-IN_8: IC1002.4(S1) ; also sheet 15
SECONDARY-ANALOG-IN_9: IC1002.5(S2) ; also sheet 15
SECONDARY-ANALOG-IN_10: IC1002.6(S3) ; also sheet 15
SECONDARY-ANALOG-IN_11: IC1002.7(S4) ; also sheet 15
SECONDARY-ANALOG-IN_12: IC1002.12(S5) ; also sheet 15
SECONDARY-ANALOG-IN_13: IC1002.11(S6) ; also sheet 15
SECONDARY-ANALOG-IN_14: IC1002.10(S7) ; also sheet 15
SECONDARY-ANALOG-IN_15: IC1002.9(S8) ; also sheet 15
SECONDARY-MUX-DATA_TEMP: C1004.2 R1009.2 ; also sheet 3
SECONDARY-MUX-DATA_USER: C1005.2 R1010.2 ; also sheet 3
SECONDARY-OPA_TEMP: IC1001.8(D) IC1003.3(+)
SECONDARY-OPA_USER: IC1002.8(D) IC1004.3(+) IC1005.8(D)
SECONDARY-SCL_1: IC1001.1(SCL) IC1002.1(SCL) IC1005.1(SCL) ; also sheet 3,12,14
SECONDARY-SDA_1: IC1001.3(SDA) IC1002.3(SDA) IC1005.3(SDA) ; also sheet 3,12,14
SECONDARY-T-SENSOR_0: IC1001.4(S1) R1008.1 ; also sheet 15
SECONDARY-T-SENSOR_1: IC1001.5(S2) R1007.1 ; also sheet 15
SECONDARY-T-SENSOR_2: IC1001.6(S3) R1006.1 ; also sheet 15
SECONDARY-T-SENSOR_3: IC1001.7(S4) R1005.1 ; also sheet 15
SECONDARY-T-SENSOR_4: IC1001.12(S5) R1004.1 ; also sheet 15
SECONDARY-T-SENSOR_5: IC1001.11(S6) R1003.1 ; also sheet 15
SECONDARY-T-SENSOR_6: IC1001.10(S7) R1002.1 ; also sheet 15
SECONDARY-T-SENSOR_7: IC1001.9(S8) R1001.1 ; also sheet 15

### Notes on the sheet
- 8 Additional Temperature Sensors / Analog Inputs
  7-bit MUX address 0x4D secondary I²C
  1001101
- Temperature Sensors 8 to 9
  6 Analog Inputs
  7-bit MUX address 0x4C secondary I²C
  1001100
- SHDN floating = amplifier on (int. pull-up)
- 8 Additional Temperature Sensors / Analog Inputs
  7-bit MUX address 0x4E secondary I²C
  1001110
- Secondary Analog Inputs

## Sheet 11 of 17: Primary Digital Inputs/Outputs
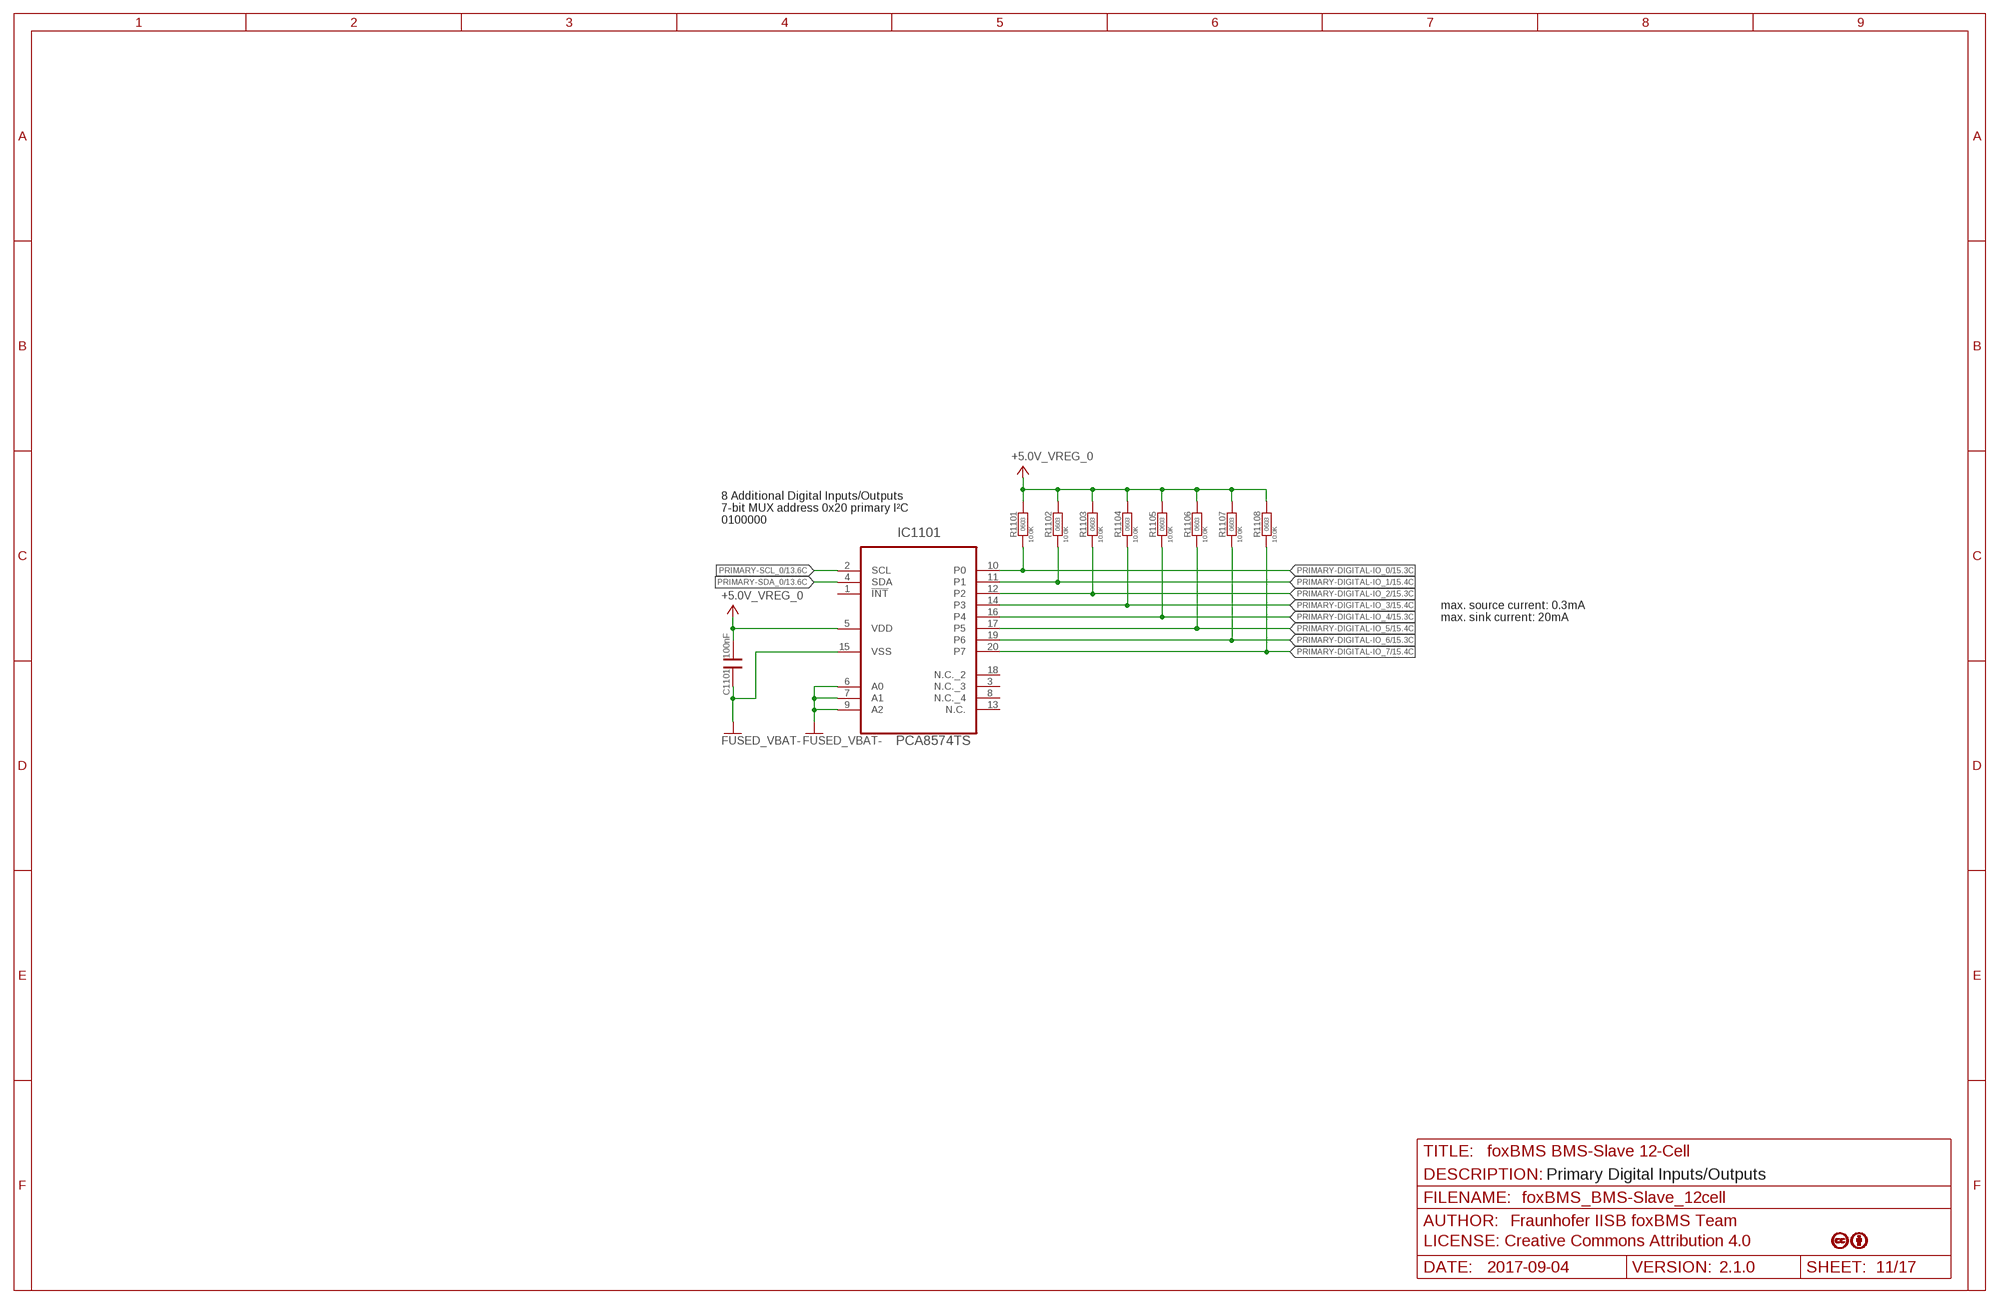
[diagram p17: schematic, sheet 11]

### Parts
C1101  100nF, 20%, 16V  100NF_0603_16V_X7R_KEMET  [C_SMD_0603_(1608)_R_KEMET_REV01]  (not fitted in variant foxBMS_Debug)  (not fitted in variant foxBMS_DC-DC-only)
IC1101  PCA8574TS  PCF8574TS/3  [SOP65P640X150-20N]  (not fitted in variant foxBMS_Debug)  (not fitted in variant foxBMS_DC-DC-only)
R1101  10,0K_0603_R_VISHAY_1%_TK100_REV_01  [R_SMD_0603_R_VISHAY_REV01]  (not fitted in variant foxBMS_Debug)  (not fitted in variant foxBMS_DC-DC-only)
R1102  10,0K_0603_R_VISHAY_1%_TK100_REV_01  [R_SMD_0603_R_VISHAY_REV01]  (not fitted in variant foxBMS_Debug)  (not fitted in variant foxBMS_DC-DC-only)
R1103  10,0K_0603_R_VISHAY_1%_TK100_REV_01  [R_SMD_0603_R_VISHAY_REV01]  (not fitted in variant foxBMS_Debug)  (not fitted in variant foxBMS_DC-DC-only)
R1104  10,0K_0603_R_VISHAY_1%_TK100_REV_01  [R_SMD_0603_R_VISHAY_REV01]  (not fitted in variant foxBMS_Debug)  (not fitted in variant foxBMS_DC-DC-only)
R1105  10,0K_0603_R_VISHAY_1%_TK100_REV_01  [R_SMD_0603_R_VISHAY_REV01]  (not fitted in variant foxBMS_Debug)  (not fitted in variant foxBMS_DC-DC-only)
R1106  10,0K_0603_R_VISHAY_1%_TK100_REV_01  [R_SMD_0603_R_VISHAY_REV01]  (not fitted in variant foxBMS_Debug)  (not fitted in variant foxBMS_DC-DC-only)
R1107  10,0K_0603_R_VISHAY_1%_TK100_REV_01  [R_SMD_0603_R_VISHAY_REV01]  (not fitted in variant foxBMS_Debug)  (not fitted in variant foxBMS_DC-DC-only)
R1108  10,0K_0603_R_VISHAY_1%_TK100_REV_01  [R_SMD_0603_R_VISHAY_REV01]  (not fitted in variant foxBMS_Debug)  (not fitted in variant foxBMS_DC-DC-only)

### Nets
+5.0V_VREG_0: C1101.2 IC1101.5(VDD) R1101.2 R1102.2 R1103.2 R1104.2 R1105.2 R1106.2 R1107.2 R1108.2 ; also sheet 2,8,9,13,15
FUSED_VBAT-: C1101.1 IC1101.6(A0) IC1101.7(A1) IC1101.9(A2) IC1101.15(VSS) ; also sheet 2,3,4,5,6,8,9,10,12,13,14,15,16
PRIMARY-DIGITAL-IO_0: IC1101.10(P0) R1101.1 ; also sheet 15
PRIMARY-DIGITAL-IO_1: IC1101.11(P1) R1102.1 ; also sheet 15
PRIMARY-DIGITAL-IO_2: IC1101.12(P2) R1103.1 ; also sheet 15
PRIMARY-DIGITAL-IO_3: IC1101.14(P3) R1104.1 ; also sheet 15
PRIMARY-DIGITAL-IO_4: IC1101.16(P4) R1105.1 ; also sheet 15
PRIMARY-DIGITAL-IO_5: IC1101.17(P5) R1106.1 ; also sheet 15
PRIMARY-DIGITAL-IO_6: IC1101.19(P6) R1107.1 ; also sheet 15
PRIMARY-DIGITAL-IO_7: IC1101.20(P7) R1108.1 ; also sheet 15
PRIMARY-SCL_0: IC1101.2(SCL) ; also sheet 2,9,13
PRIMARY-SDA_0: IC1101.4(SDA) ; also sheet 2,9,13
Unconnected: IC1101.1(!INT) IC1101.3(N.C._3) IC1101.8(N.C._4) IC1101.13(N.C.) IC1101.18(N.C._2)

### Notes on the sheet
- 8 Additional Digital Inputs/Outputs
  7-bit MUX address 0x20 primary I²C
  0100000
- max. source current: 0.3mA
  max. sink current: 20mA
- Primary Digital Inputs/Outputs

## Sheet 12 of 17: Secondary Digital Inputs/Outputs
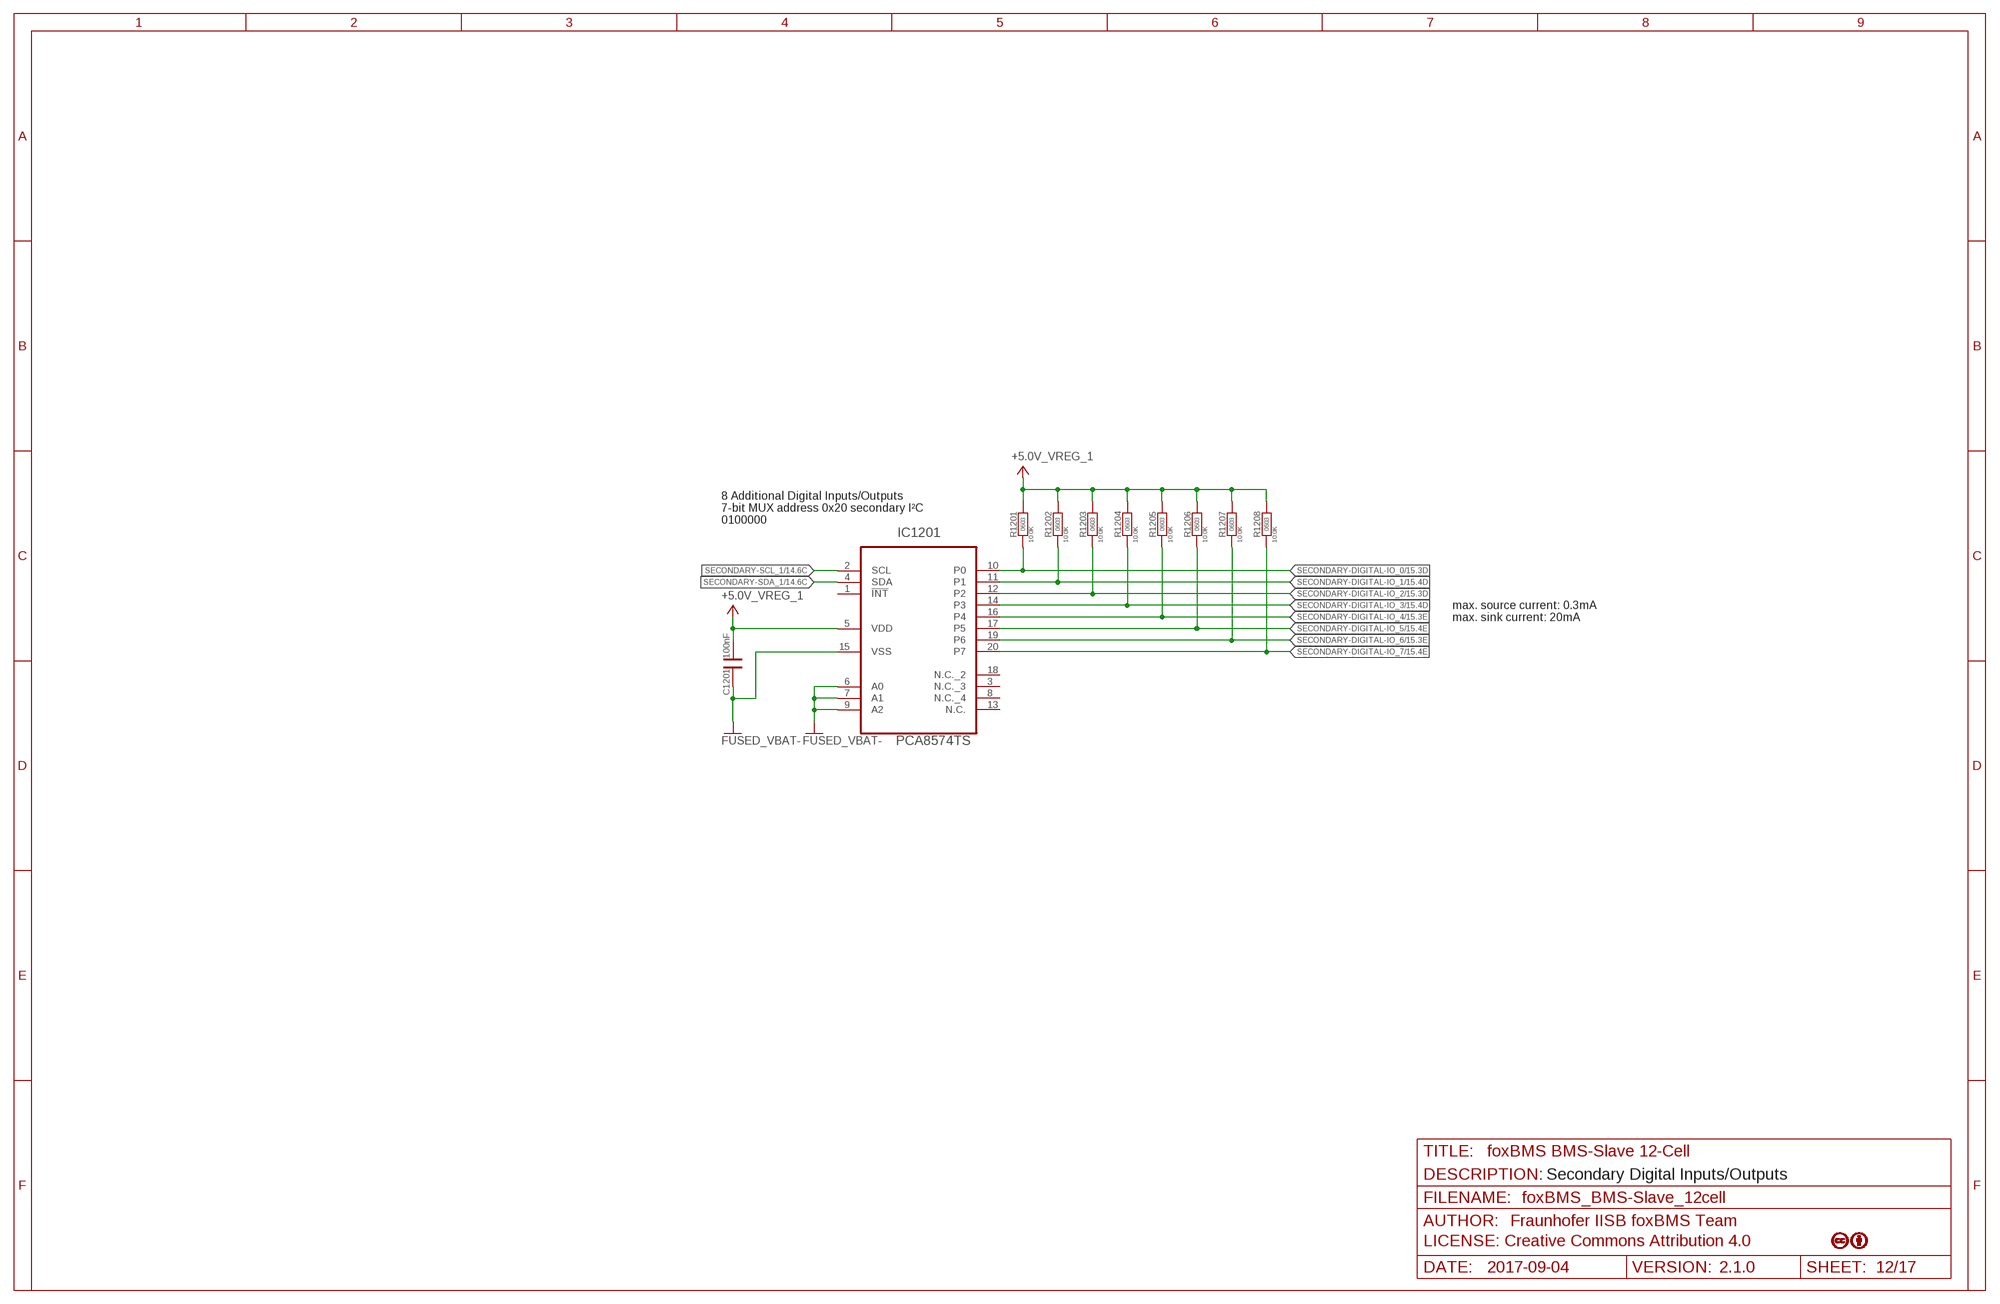
[diagram p18: schematic, sheet 12]

### Parts
C1201  100nF, 20%, 16V  100NF_0603_16V_X7R_KEMET  [C_SMD_0603_(1608)_R_KEMET_REV01]  (not fitted in variant foxBMS_Debug)  (not fitted in variant foxBMS_DC-DC-only)
IC1201  PCA8574TS  PCF8574TS/3  [SOP65P640X150-20N]  (not fitted in variant foxBMS_Debug)  (not fitted in variant foxBMS_DC-DC-only)
R1201  10,0K_0603_R_VISHAY_1%_TK100_REV_01  [R_SMD_0603_R_VISHAY_REV01]  (not fitted in variant foxBMS_Debug)  (not fitted in variant foxBMS_DC-DC-only)
R1202  10,0K_0603_R_VISHAY_1%_TK100_REV_01  [R_SMD_0603_R_VISHAY_REV01]  (not fitted in variant foxBMS_Debug)  (not fitted in variant foxBMS_DC-DC-only)
R1203  10,0K_0603_R_VISHAY_1%_TK100_REV_01  [R_SMD_0603_R_VISHAY_REV01]  (not fitted in variant foxBMS_Debug)  (not fitted in variant foxBMS_DC-DC-only)
R1204  10,0K_0603_R_VISHAY_1%_TK100_REV_01  [R_SMD_0603_R_VISHAY_REV01]  (not fitted in variant foxBMS_Debug)  (not fitted in variant foxBMS_DC-DC-only)
R1205  10,0K_0603_R_VISHAY_1%_TK100_REV_01  [R_SMD_0603_R_VISHAY_REV01]  (not fitted in variant foxBMS_Debug)  (not fitted in variant foxBMS_DC-DC-only)
R1206  10,0K_0603_R_VISHAY_1%_TK100_REV_01  [R_SMD_0603_R_VISHAY_REV01]  (not fitted in variant foxBMS_Debug)  (not fitted in variant foxBMS_DC-DC-only)
R1207  10,0K_0603_R_VISHAY_1%_TK100_REV_01  [R_SMD_0603_R_VISHAY_REV01]  (not fitted in variant foxBMS_Debug)  (not fitted in variant foxBMS_DC-DC-only)
R1208  10,0K_0603_R_VISHAY_1%_TK100_REV_01  [R_SMD_0603_R_VISHAY_REV01]  (not fitted in variant foxBMS_Debug)  (not fitted in variant foxBMS_DC-DC-only)

### Nets
+5.0V_VREG_1: C1201.2 IC1201.5(VDD) R1201.2 R1202.2 R1203.2 R1204.2 R1205.2 R1206.2 R1207.2 R1208.2 ; also sheet 3,8,10,14,15
FUSED_VBAT-: C1201.1 IC1201.6(A0) IC1201.7(A1) IC1201.9(A2) IC1201.15(VSS) ; also sheet 2,3,4,5,6,8,9,10,11,13,14,15,16
SECONDARY-DIGITAL-IO_0: IC1201.10(P0) R1201.1 ; also sheet 15
SECONDARY-DIGITAL-IO_1: IC1201.11(P1) R1202.1 ; also sheet 15
SECONDARY-DIGITAL-IO_2: IC1201.12(P2) R1203.1 ; also sheet 15
SECONDARY-DIGITAL-IO_3: IC1201.14(P3) R1204.1 ; also sheet 15
SECONDARY-DIGITAL-IO_4: IC1201.16(P4) R1205.1 ; also sheet 15
SECONDARY-DIGITAL-IO_5: IC1201.17(P5) R1206.1 ; also sheet 15
SECONDARY-DIGITAL-IO_6: IC1201.19(P6) R1207.1 ; also sheet 15
SECONDARY-DIGITAL-IO_7: IC1201.20(P7) R1208.1 ; also sheet 15
SECONDARY-SCL_1: IC1201.2(SCL) ; also sheet 3,10,14
SECONDARY-SDA_1: IC1201.4(SDA) ; also sheet 3,10,14
Unconnected: IC1201.1(!INT) IC1201.3(N.C._3) IC1201.8(N.C._4) IC1201.13(N.C.) IC1201.18(N.C._2)

### Notes on the sheet
- 8 Additional Digital Inputs/Outputs
  7-bit MUX address 0x20 secondary I²C
  0100000
- max. source current: 0.3mA
  max. sink current: 20mA
- Secondary Digital Inputs/Outputs

## Sheet 13 of 17: Primary EEPROM and T-SENSOR
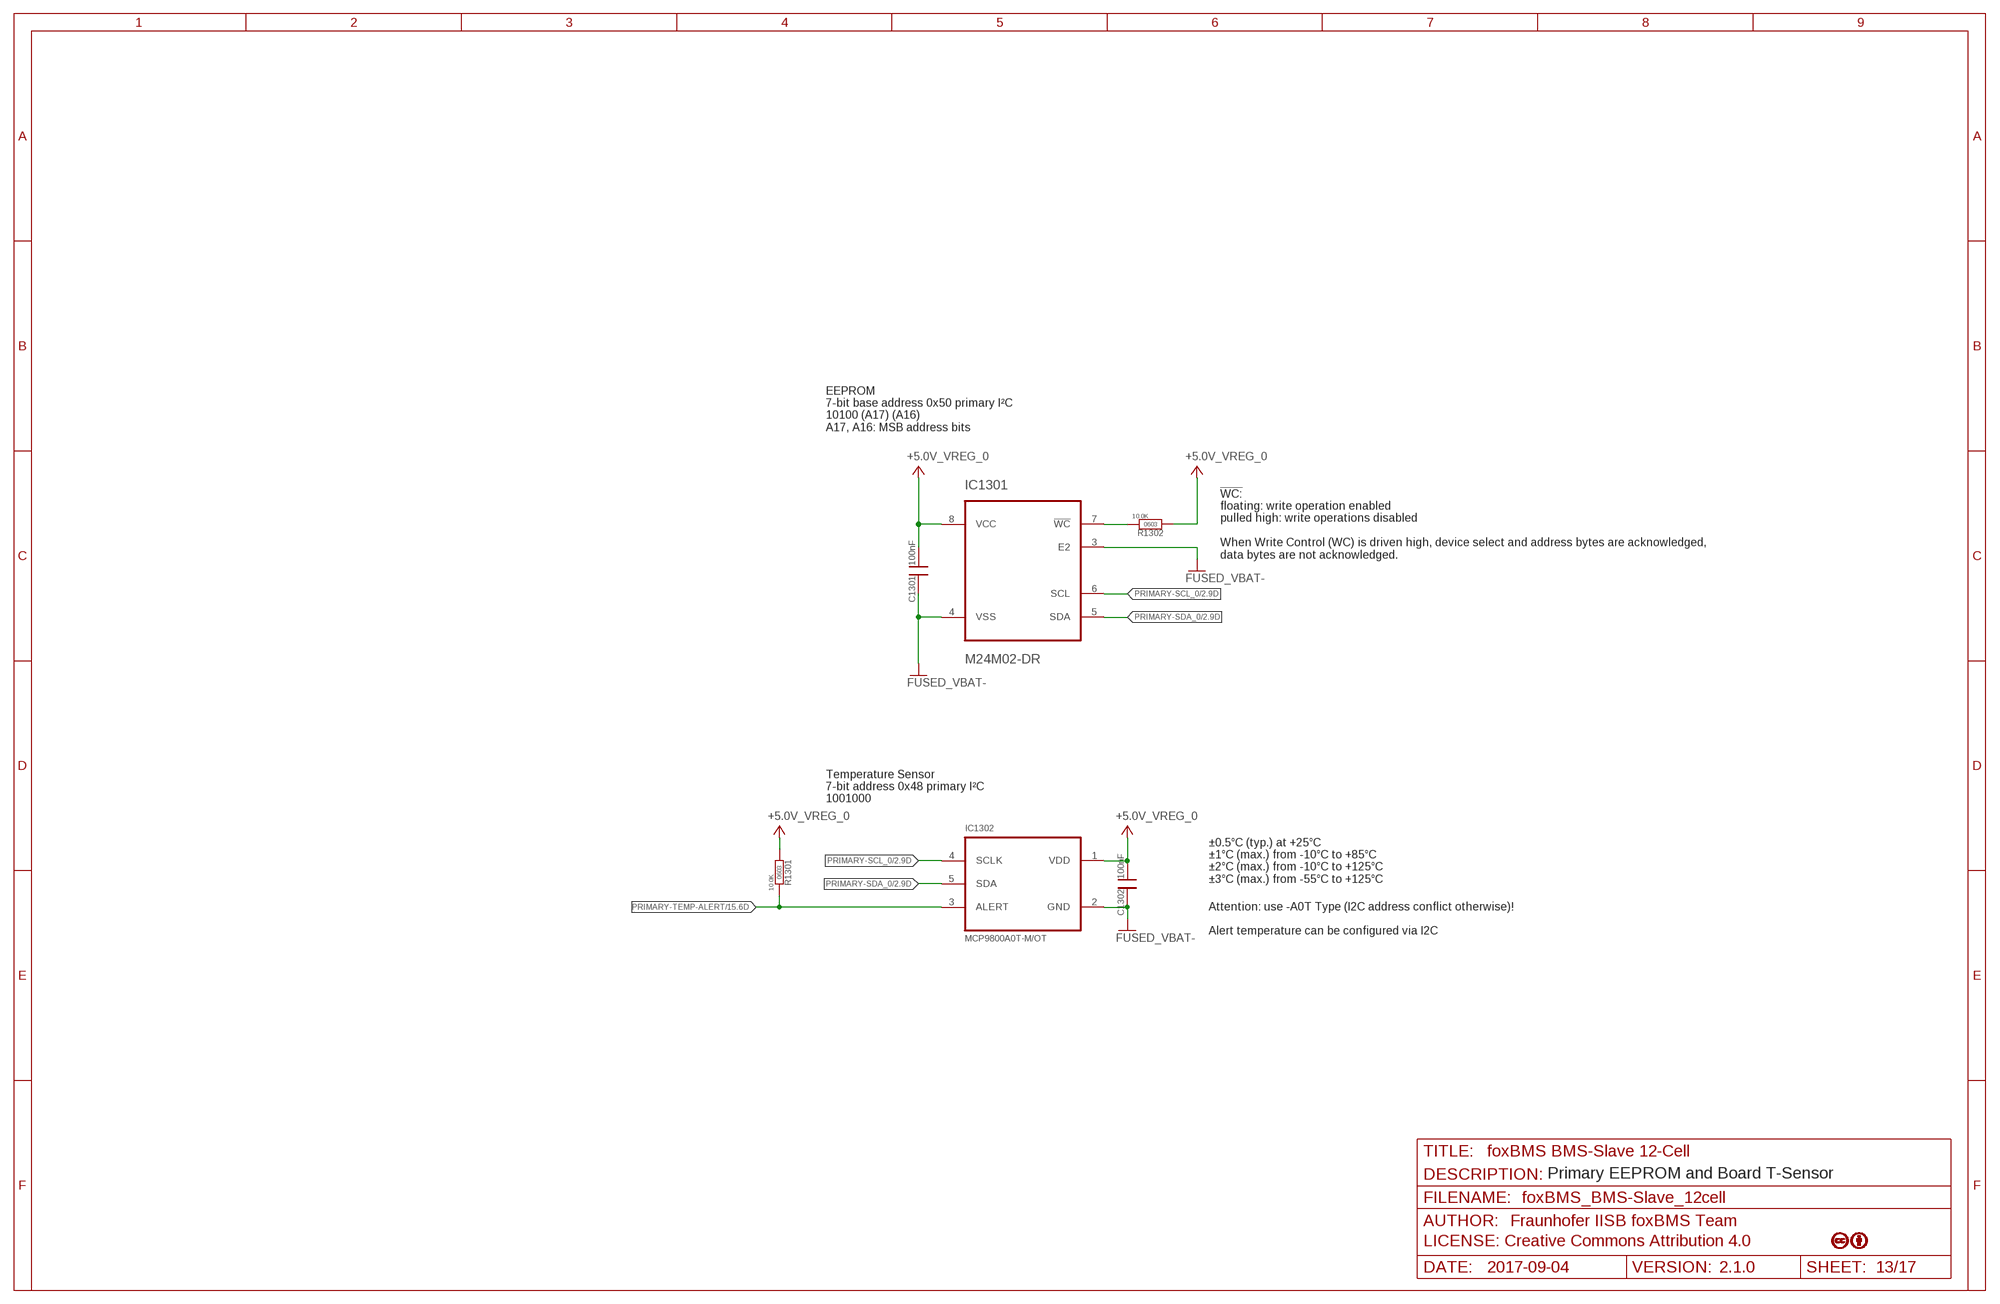
[diagram p19: schematic, sheet 13]

### Parts
C1301  100nF, 20%, 16V  100NF_0603_16V_X7R_KEMET  [C_SMD_0603_(1608)_R_KEMET_REV01]  (not fitted in variant foxBMS_Debug)  (not fitted in variant foxBMS_DC-DC-only)
C1302  100nF, 20%, 16V  100NF_0603_16V_X7R_KEMET  [C_SMD_0603_(1608)_R_KEMET_REV01]  (not fitted in variant foxBMS_Debug)  (not fitted in variant foxBMS_DC-DC-only)
IC1301  M24M02-DR  [SOIC127P600X175-8N]  (not fitted in variant foxBMS_Debug)  (not fitted in variant foxBMS_DC-DC-only)
IC1302  MCP9800A0T-M/OT  [SOT95P280X145-5N]  (not fitted in variant foxBMS_Debug)  (not fitted in variant foxBMS_DC-DC-only)
R1301  10,0K_0603_R_VISHAY_1%_TK100_REV_01  [R_SMD_0603_R_VISHAY_REV01]  (not fitted in variant foxBMS_Debug)  (not fitted in variant foxBMS_DC-DC-only)
R1302  10,0K_0603_R_VISHAY_1%_TK100_REV_01  [R_SMD_0603_R_VISHAY_REV01]  (not fitted in variant foxBMS_Standard)  (not fitted in variant foxBMS_Debug)  (not fitted in variant foxBMS_DC-DC-only)

### Nets
+5.0V_VREG_0: C1301.2 C1302.2 IC1301.8(VCC) IC1302.1(VDD) R1301.2 R1302.2 ; also sheet 2,8,9,11,15
FUSED_VBAT-: C1301.1 C1302.1 IC1301.3(E2) IC1301.4(VSS) IC1302.2(GND) ; also sheet 2,3,4,5,6,8,9,10,11,12,14,15,16
N$94: IC1301.7(!WC) R1302.1
PRIMARY-SCL_0: IC1301.6(SCL) IC1302.4(SCLK) ; also sheet 2,9,11
PRIMARY-SDA_0: IC1301.5(SDA) IC1302.5(SDA) ; also sheet 2,9,11
PRIMARY-TEMP-ALERT: IC1302.3(ALERT) R1301.1 ; also sheet 15

### Notes on the sheet
- EEPROM
  7-bit base address 0x50 primary I²C
  10100 (A17) (A16)
  A17, A16: MSB address bits
- !WC:
  floating: write operation enabled
  pulled high: write operations disabled
  
  When Write Control (WC) is driven high, device select and address bytes are acknowledged, 
  data bytes are not acknowledged.
- Temperature Sensor
  7-bit address 0x48 primary I²C
  1001000
- ±0.5°C (typ.) at +25°C
  ±1°C (max.) from -10°C to +85°C
  ±2°C (max.) from -10°C to +125°C
  ±3°C (max.) from -55°C to +125°C
- Attention: use -A0T Type (I2C address conflict otherwise)!
  
  Alert temperature can be configured via I2C
- Primary EEPROM and Board T-Sensor

## Sheet 14 of 17: Secondary EEPROM and T-SENSOR
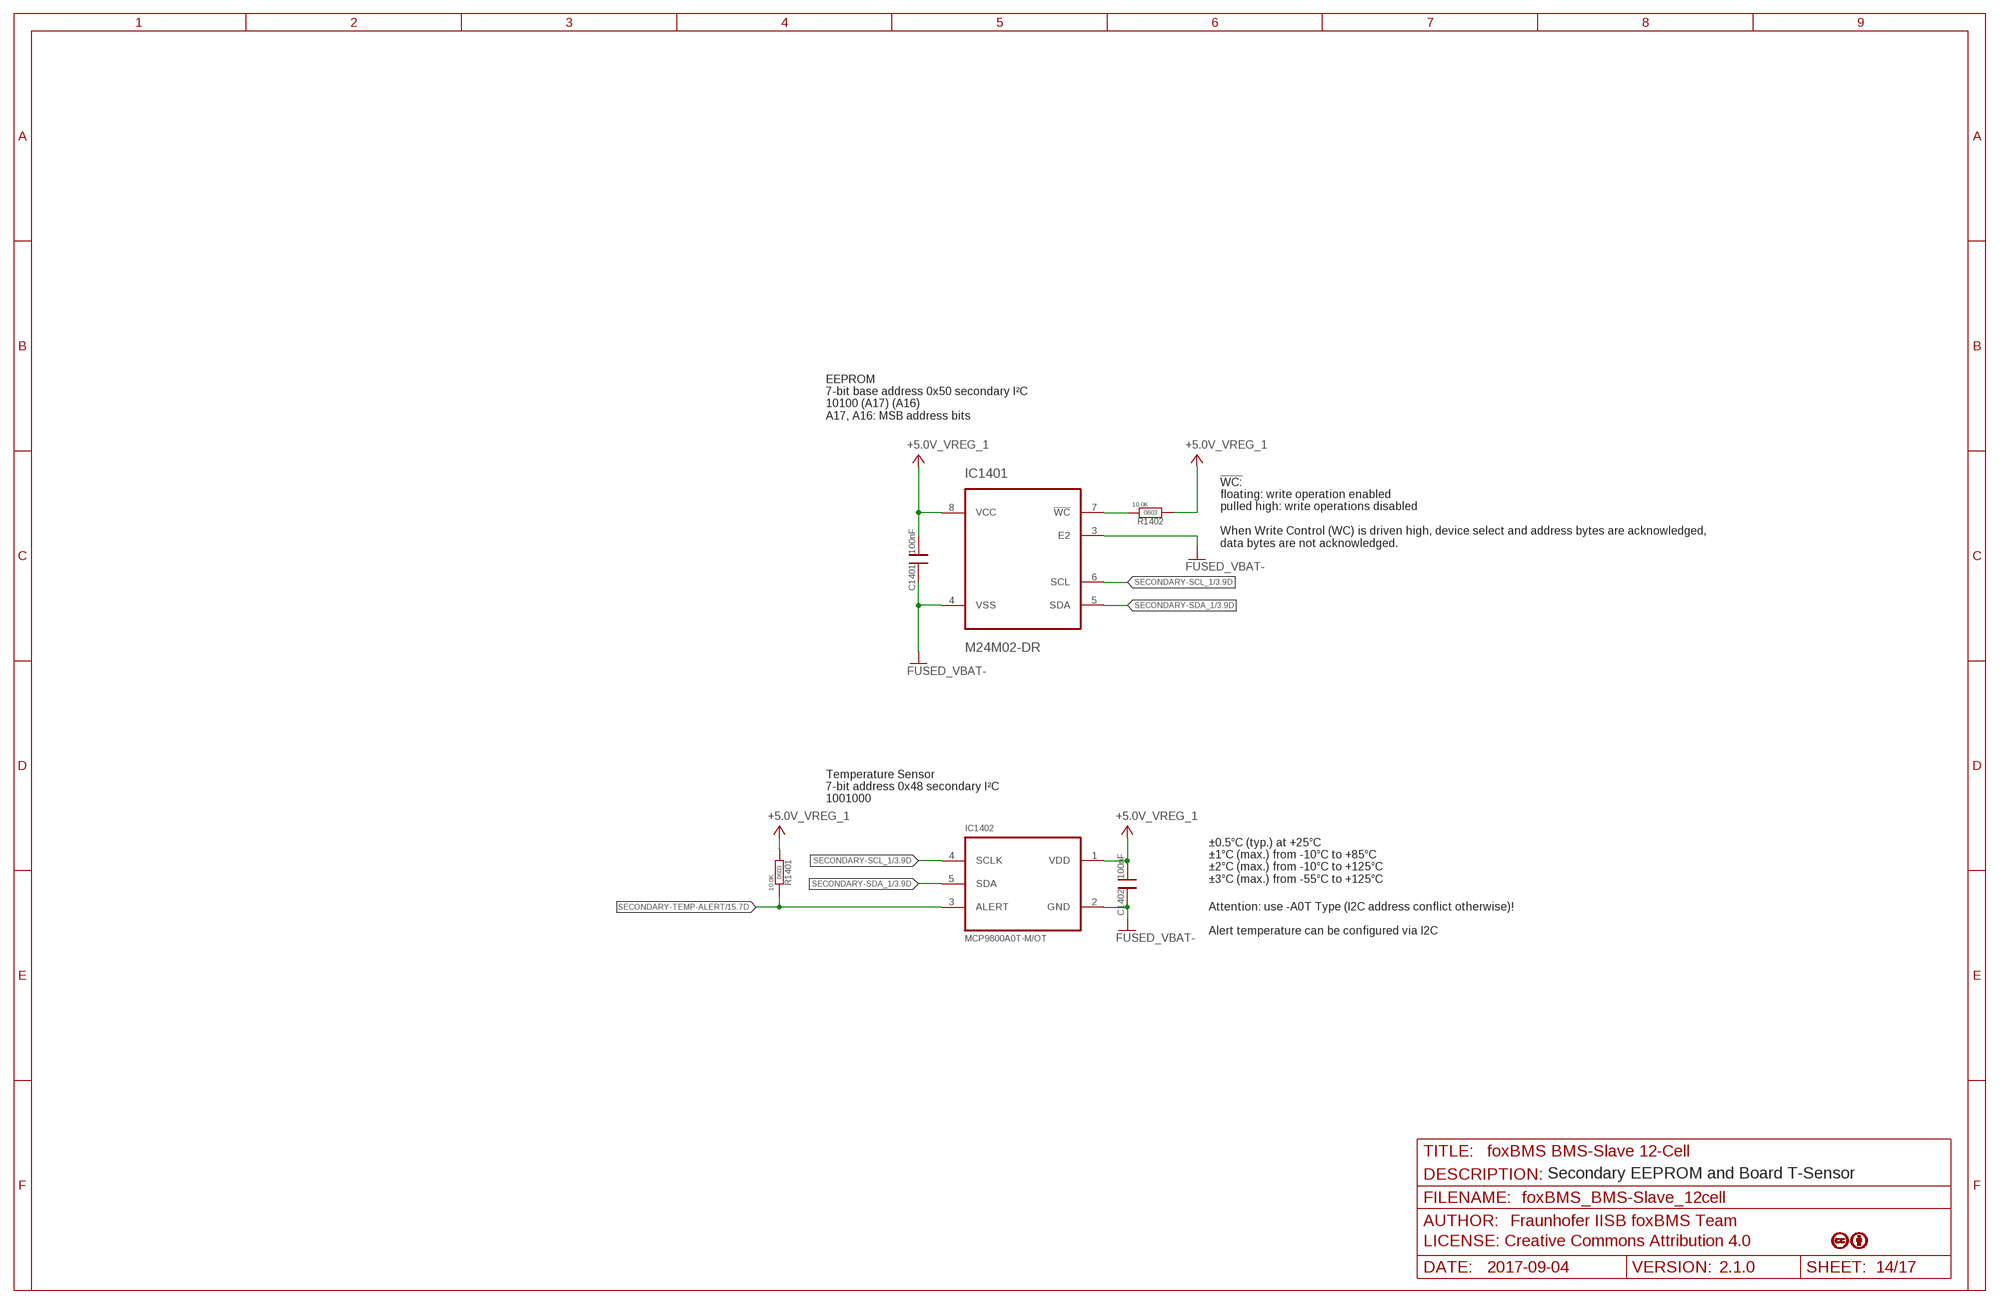
[diagram p20: schematic, sheet 14]

### Parts
C1401  100nF, 20%, 16V  100NF_0603_16V_X7R_KEMET  [C_SMD_0603_(1608)_R_KEMET_REV01]  (not fitted in variant foxBMS_Debug)  (not fitted in variant foxBMS_DC-DC-only)
C1402  100nF, 20%, 16V  100NF_0603_16V_X7R_KEMET  [C_SMD_0603_(1608)_R_KEMET_REV01]  (not fitted in variant foxBMS_Debug)  (not fitted in variant foxBMS_DC-DC-only)
IC1401  M24M02-DR  [SOIC127P600X175-8N]  (not fitted in variant foxBMS_Debug)  (not fitted in variant foxBMS_DC-DC-only)
IC1402  MCP9800A0T-M/OT  [SOT95P280X145-5N]  (not fitted in variant foxBMS_Debug)  (not fitted in variant foxBMS_DC-DC-only)
R1401  10,0K_0603_R_VISHAY_1%_TK100_REV_01  [R_SMD_0603_R_VISHAY_REV01]  (not fitted in variant foxBMS_Debug)  (not fitted in variant foxBMS_DC-DC-only)
R1402  10,0K_0603_R_VISHAY_1%_TK100_REV_01  [R_SMD_0603_R_VISHAY_REV01]  (not fitted in variant foxBMS_Standard)  (not fitted in variant foxBMS_Debug)  (not fitted in variant foxBMS_DC-DC-only)

### Nets
+5.0V_VREG_1: C1401.2 C1402.2 IC1401.8(VCC) IC1402.1(VDD) R1401.2 R1402.2 ; also sheet 3,8,10,12,15
FUSED_VBAT-: C1401.1 C1402.1 IC1401.3(E2) IC1401.4(VSS) IC1402.2(GND) ; also sheet 2,3,4,5,6,8,9,10,11,12,13,15,16
N$95: IC1401.7(!WC) R1402.1
SECONDARY-SCL_1: IC1401.6(SCL) IC1402.4(SCLK) ; also sheet 3,10,12
SECONDARY-SDA_1: IC1401.5(SDA) IC1402.5(SDA) ; also sheet 3,10,12
SECONDARY-TEMP-ALERT: IC1402.3(ALERT) R1401.1 ; also sheet 15

### Notes on the sheet
- EEPROM
  7-bit base address 0x50 secondary I²C
  10100 (A17) (A16)
  A17, A16: MSB address bits
- !WC:
  floating: write operation enabled
  pulled high: write operations disabled
  
  When Write Control (WC) is driven high, device select and address bytes are acknowledged, 
  data bytes are not acknowledged.
- Temperature Sensor
  7-bit address 0x48 secondary I²C
  1001000
- ±0.5°C (typ.) at +25°C
  ±1°C (max.) from -10°C to +85°C
  ±2°C (max.) from -10°C to +125°C
  ±3°C (max.) from -55°C to +125°C
- Attention: use -A0T Type (I2C address conflict otherwise)!
  
  Alert temperature can be configured via I2C
- Secondary EEPROM and Board T-Sensor

## Sheet 15 of 17: Connectors
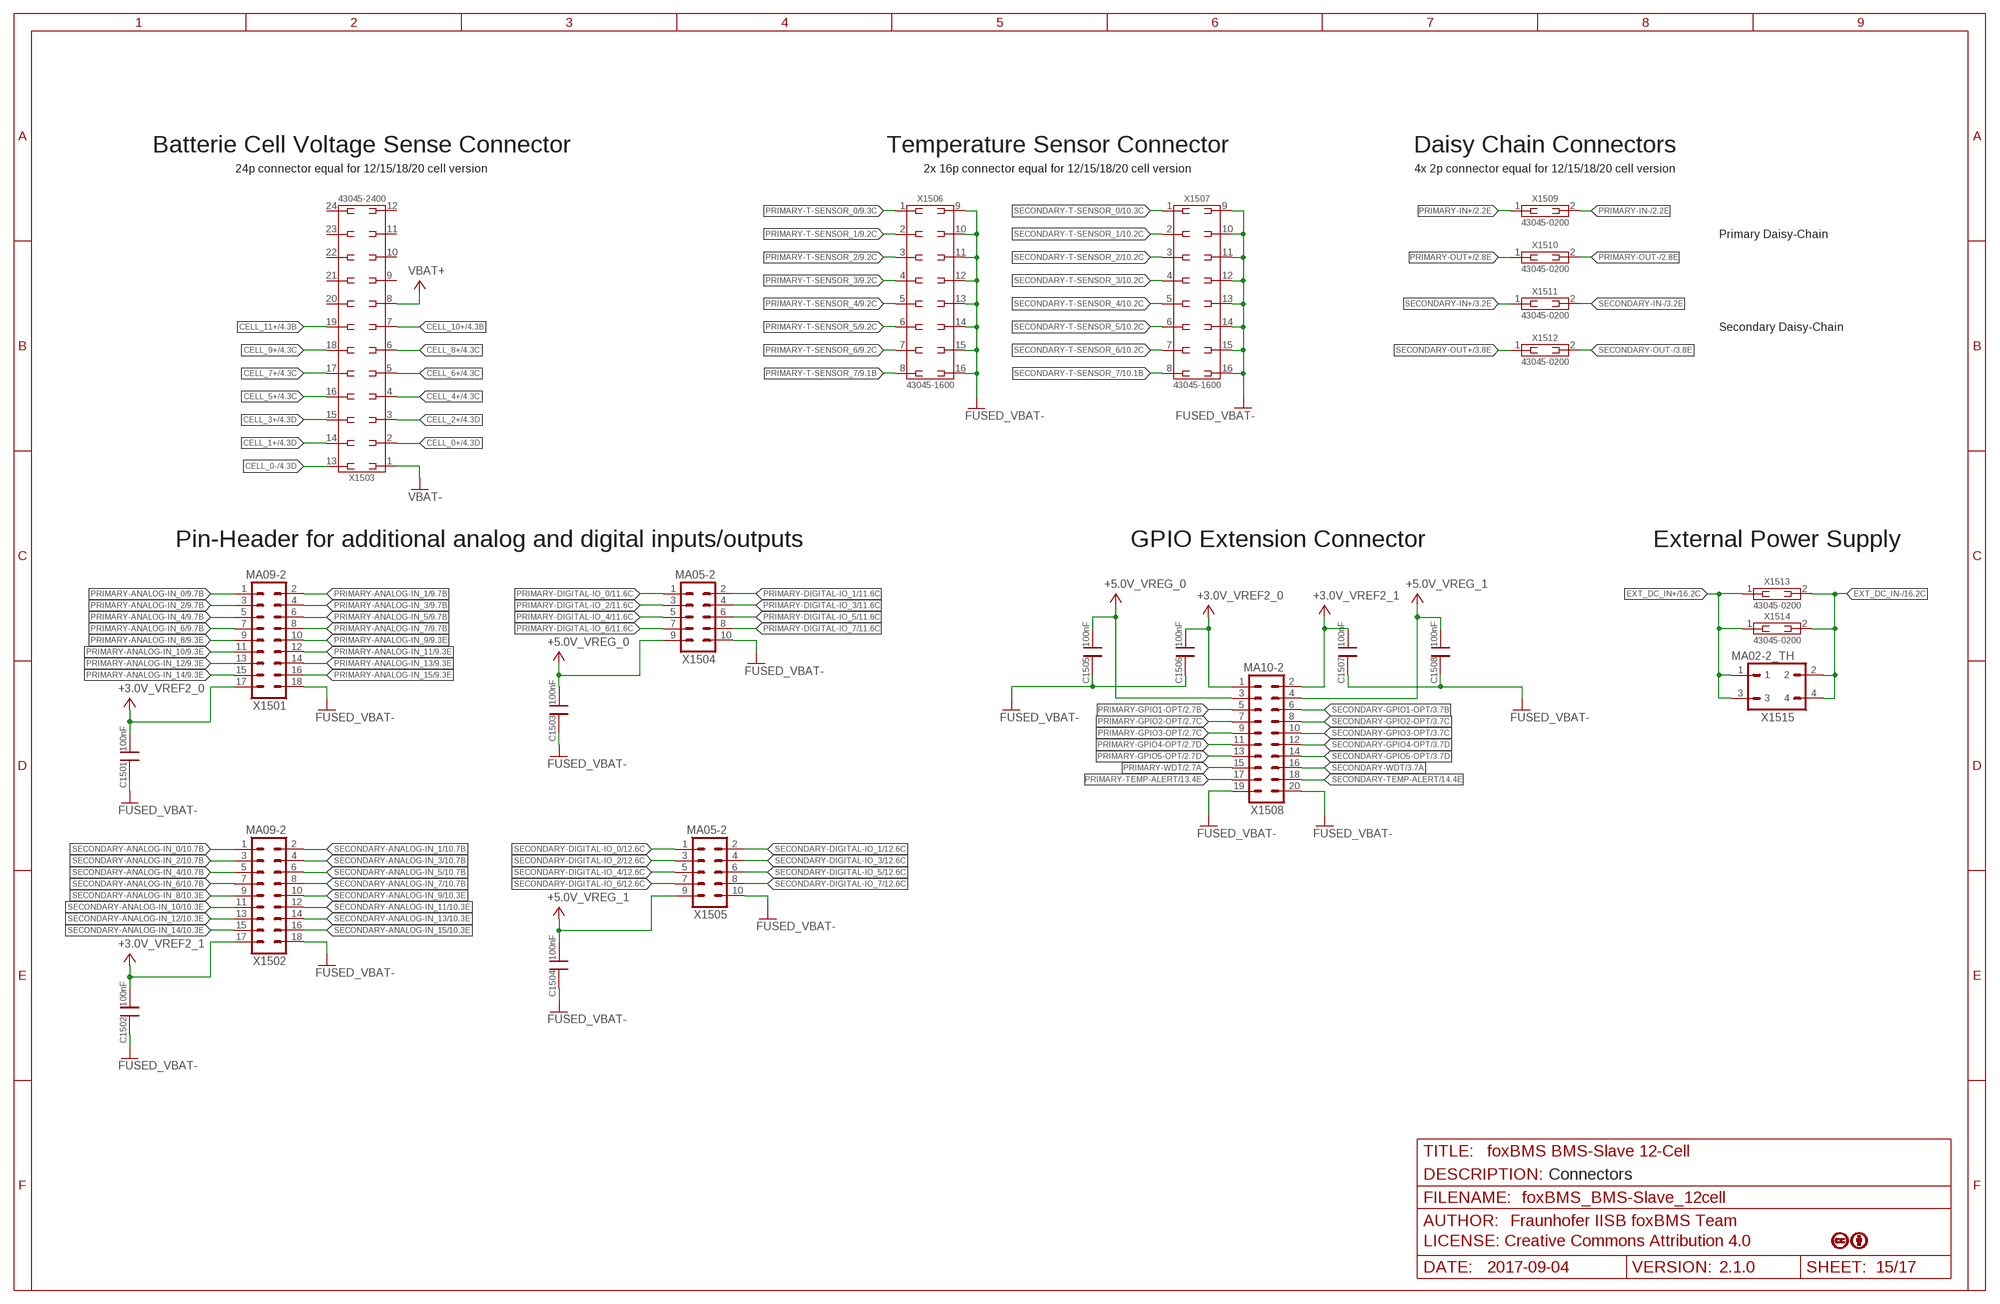
[diagram p21: schematic, sheet 15]

### Parts
C1501  100nF, 20%, 16V  100NF_0603_16V_X7R_KEMET  [C_SMD_0603_(1608)_R_KEMET_REV01]  (not fitted in variant foxBMS_Debug)  (not fitted in variant foxBMS_DC-DC-only)
C1502  100nF, 20%, 16V  100NF_0603_16V_X7R_KEMET  [C_SMD_0603_(1608)_R_KEMET_REV01]  (not fitted in variant foxBMS_Debug)  (not fitted in variant foxBMS_DC-DC-only)
C1503  100nF, 20%, 16V  100NF_0603_16V_X7R_KEMET  [C_SMD_0603_(1608)_R_KEMET_REV01]  (not fitted in variant foxBMS_Debug)  (not fitted in variant foxBMS_DC-DC-only)
C1504  100nF, 20%, 16V  100NF_0603_16V_X7R_KEMET  [C_SMD_0603_(1608)_R_KEMET_REV01]  (not fitted in variant foxBMS_Debug)  (not fitted in variant foxBMS_DC-DC-only)
C1505  100nF, 20%, 16V  100NF_0603_16V_X7R_KEMET  [C_SMD_0603_(1608)_R_KEMET_REV01]  (not fitted in variant foxBMS_Debug)  (not fitted in variant foxBMS_DC-DC-only)
C1506  100nF, 20%, 16V  100NF_0603_16V_X7R_KEMET  [C_SMD_0603_(1608)_R_KEMET_REV01]  (not fitted in variant foxBMS_Debug)  (not fitted in variant foxBMS_DC-DC-only)
C1507  100nF, 20%, 16V  100NF_0603_16V_X7R_KEMET  [C_SMD_0603_(1608)_R_KEMET_REV01]  (not fitted in variant foxBMS_Debug)  (not fitted in variant foxBMS_DC-DC-only)
C1508  100nF, 20%, 16V  100NF_0603_16V_X7R_KEMET  [C_SMD_0603_(1608)_R_KEMET_REV01]  (not fitted in variant foxBMS_Debug)  (not fitted in variant foxBMS_DC-DC-only)
X1501  MA09-2  [MA09-2]  (not fitted in variant foxBMS_Debug)  (not fitted in variant foxBMS_DC-DC-only)
X1502  MA09-2  [MA09-2]  (not fitted in variant foxBMS_Debug)  (not fitted in variant foxBMS_DC-DC-only)
X1503  43045-2400_MOLEX_24PIN  [X_TH_MOLEX_43045-2400_R_REV01]  (not fitted in variant foxBMS_DC-DC-only)
X1504  MA05-2  [MA05-2]  (not fitted in variant foxBMS_Debug)  (not fitted in variant foxBMS_DC-DC-only)
X1505  MA05-2  [MA05-2]  (not fitted in variant foxBMS_Debug)  (not fitted in variant foxBMS_DC-DC-only)
X1506  43045-1600_MOLEX_16PIN  [X_TH_MOLEX_43045-1600_R_REV01]  (not fitted in variant foxBMS_Debug)  (not fitted in variant foxBMS_DC-DC-only)
X1507  43045-1600_MOLEX_16PIN  [X_TH_MOLEX_43045-1600_R_REV01]  (not fitted in variant foxBMS_Debug)  (not fitted in variant foxBMS_DC-DC-only)
X1508  MA10-2  [MA10-2]  (not fitted in variant foxBMS_Debug)  (not fitted in variant foxBMS_DC-DC-only)
X1509  43045-0200_MOLEX_2PIN  [X_TH_MOLEX_43045-0200_R_REV01]  (not fitted in variant foxBMS_DC-DC-only)
X1510  43045-0200_MOLEX_2PIN  [X_TH_MOLEX_43045-0200_R_REV01]  (not fitted in variant foxBMS_DC-DC-only)
X1511  43045-0200_MOLEX_2PIN  [X_TH_MOLEX_43045-0200_R_REV01]  (not fitted in variant foxBMS_DC-DC-only)
X1512  43045-0200_MOLEX_2PIN  [X_TH_MOLEX_43045-0200_R_REV01]  (not fitted in variant foxBMS_DC-DC-only)
X1513  43045-0200_MOLEX_2PIN  [X_TH_MOLEX_43045-0200_R_REV01]
X1514  43045-0200_MOLEX_2PIN  [X_TH_MOLEX_43045-0200_R_REV01]
X1515  MA02-2_TH  [MA02-2]  (not fitted in variant foxBMS_Debug)  (not fitted in variant foxBMS_DC-DC-only)

### Nets
+3.0V_VREF2_0: C1501.2 C1506.2 X1501.17 X1508.1 ; also sheet 2,9
+3.0V_VREF2_1: C1502.2 C1507.2 X1502.17 X1508.2 ; also sheet 3,10
+5.0V_VREG_0: C1503.2 C1505.2 X1504.9 X1508.3 ; also sheet 2,8,9,11,13
+5.0V_VREG_1: C1504.2 C1508.2 X1505.9 X1508.4 ; also sheet 3,8,10,12,14
CELL_0+: X1503.2 ; also sheet 4
CELL_0-: X1503.13 ; also sheet 4
CELL_1+: X1503.14 ; also sheet 4
CELL_2+: X1503.3 ; also sheet 4
CELL_3+: X1503.15 ; also sheet 4
CELL_4+: X1503.4 ; also sheet 4
CELL_5+: X1503.16 ; also sheet 4
CELL_6+: X1503.5 ; also sheet 4
CELL_7+: X1503.17 ; also sheet 4
CELL_8+: X1503.6 ; also sheet 4
CELL_9+: X1503.18 ; also sheet 4
CELL_10+: X1503.7 ; also sheet 4
CELL_11+: X1503.19 ; also sheet 4
EXT_DC_IN+: X1513.1 X1514.1 X1515.1 X1515.3 ; also sheet 16
EXT_DC_IN-: X1513.2 X1514.2 X1515.2 X1515.4 ; also sheet 16
FUSED_VBAT-: C1501.1 C1502.1 C1503.1 C1504.1 C1505.1 C1506.1 C1507.1 C1508.1 X1501.18 X1502.18 X1504.10 X1505.10 X1506.9 X1506.10 X1506.11 X1506.12 X1506.13 X1506.14 X1506.15 X1506.16 X1507.9 X1507.10 X1507.11 X1507.12 X1507.13 X1507.14 X1507.15 X1507.16 X1508.19 X1508.20 ; also sheet 2,3,4,5,6,8,9,10,11,12,13,14,16
PRIMARY-ANALOG-IN_0: X1501.1 ; also sheet 9
PRIMARY-ANALOG-IN_1: X1501.2 ; also sheet 9
PRIMARY-ANALOG-IN_2: X1501.3 ; also sheet 9
PRIMARY-ANALOG-IN_3: X1501.4 ; also sheet 9
PRIMARY-ANALOG-IN_4: X1501.5 ; also sheet 9
PRIMARY-ANALOG-IN_5: X1501.6 ; also sheet 9
PRIMARY-ANALOG-IN_6: X1501.7 ; also sheet 9
PRIMARY-ANALOG-IN_7: X1501.8 ; also sheet 9
PRIMARY-ANALOG-IN_8: X1501.9 ; also sheet 9
PRIMARY-ANALOG-IN_9: X1501.10 ; also sheet 9
PRIMARY-ANALOG-IN_10: X1501.11 ; also sheet 9
PRIMARY-ANALOG-IN_11: X1501.12 ; also sheet 9
PRIMARY-ANALOG-IN_12: X1501.13 ; also sheet 9
PRIMARY-ANALOG-IN_13: X1501.14 ; also sheet 9
PRIMARY-ANALOG-IN_14: X1501.15 ; also sheet 9
PRIMARY-ANALOG-IN_15: X1501.16 ; also sheet 9
PRIMARY-DIGITAL-IO_0: X1504.1 ; also sheet 11
PRIMARY-DIGITAL-IO_1: X1504.2 ; also sheet 11
PRIMARY-DIGITAL-IO_2: X1504.3 ; also sheet 11
PRIMARY-DIGITAL-IO_3: X1504.4 ; also sheet 11
PRIMARY-DIGITAL-IO_4: X1504.5 ; also sheet 11
PRIMARY-DIGITAL-IO_5: X1504.6 ; also sheet 11
PRIMARY-DIGITAL-IO_6: X1504.7 ; also sheet 11
PRIMARY-DIGITAL-IO_7: X1504.8 ; also sheet 11
PRIMARY-GPIO1-OPT: X1508.5 ; also sheet 2
PRIMARY-GPIO2-OPT: X1508.7 ; also sheet 2
PRIMARY-GPIO3-OPT: X1508.9 ; also sheet 2
PRIMARY-GPIO4-OPT: X1508.11 ; also sheet 2
PRIMARY-GPIO5-OPT: X1508.13 ; also sheet 2
PRIMARY-IN+: X1509.1 ; also sheet 2
PRIMARY-IN-: X1509.2 ; also sheet 2
PRIMARY-OUT+: X1510.1 ; also sheet 2
PRIMARY-OUT-: X1510.2 ; also sheet 2
PRIMARY-T-SENSOR_0: X1506.1 ; also sheet 9
PRIMARY-T-SENSOR_1: X1506.2 ; also sheet 9
PRIMARY-T-SENSOR_2: X1506.3 ; also sheet 9
PRIMARY-T-SENSOR_3: X1506.4 ; also sheet 9
PRIMARY-T-SENSOR_4: X1506.5 ; also sheet 9
PRIMARY-T-SENSOR_5: X1506.6 ; also sheet 9
PRIMARY-T-SENSOR_6: X1506.7 ; also sheet 9
PRIMARY-T-SENSOR_7: X1506.8 ; also sheet 9
PRIMARY-TEMP-ALERT: X1508.17 ; also sheet 13
PRIMARY-WDT: X1508.15 ; also sheet 2
SECONDARY-ANALOG-IN_0: X1502.1 ; also sheet 10
SECONDARY-ANALOG-IN_1: X1502.2 ; also sheet 10
SECONDARY-ANALOG-IN_2: X1502.3 ; also sheet 10
SECONDARY-ANALOG-IN_3: X1502.4 ; also sheet 10
SECONDARY-ANALOG-IN_4: X1502.5 ; also sheet 10
SECONDARY-ANALOG-IN_5: X1502.6 ; also sheet 10
SECONDARY-ANALOG-IN_6: X1502.7 ; also sheet 10
SECONDARY-ANALOG-IN_7: X1502.8 ; also sheet 10
SECONDARY-ANALOG-IN_8: X1502.9 ; also sheet 10
SECONDARY-ANALOG-IN_9: X1502.10 ; also sheet 10
SECONDARY-ANALOG-IN_10: X1502.11 ; also sheet 10
SECONDARY-ANALOG-IN_11: X1502.12 ; also sheet 10
SECONDARY-ANALOG-IN_12: X1502.13 ; also sheet 10
SECONDARY-ANALOG-IN_13: X1502.14 ; also sheet 10
SECONDARY-ANALOG-IN_14: X1502.15 ; also sheet 10
SECONDARY-ANALOG-IN_15: X1502.16 ; also sheet 10
SECONDARY-DIGITAL-IO_0: X1505.1 ; also sheet 12
SECONDARY-DIGITAL-IO_1: X1505.2 ; also sheet 12
SECONDARY-DIGITAL-IO_2: X1505.3 ; also sheet 12
SECONDARY-DIGITAL-IO_3: X1505.4 ; also sheet 12
SECONDARY-DIGITAL-IO_4: X1505.5 ; also sheet 12
SECONDARY-DIGITAL-IO_5: X1505.6 ; also sheet 12
SECONDARY-DIGITAL-IO_6: X1505.7 ; also sheet 12
SECONDARY-DIGITAL-IO_7: X1505.8 ; also sheet 12
SECONDARY-GPIO1-OPT: X1508.6 ; also sheet 3
SECONDARY-GPIO2-OPT: X1508.8 ; also sheet 3
SECONDARY-GPIO3-OPT: X1508.10 ; also sheet 3
SECONDARY-GPIO4-OPT: X1508.12 ; also sheet 3
SECONDARY-GPIO5-OPT: X1508.14 ; also sheet 3
SECONDARY-IN+: X1511.1 ; also sheet 3
SECONDARY-IN-: X1511.2 ; also sheet 3
SECONDARY-OUT+: X1512.1 ; also sheet 3
SECONDARY-OUT-: X1512.2 ; also sheet 3
SECONDARY-T-SENSOR_0: X1507.1 ; also sheet 10
SECONDARY-T-SENSOR_1: X1507.2 ; also sheet 10
SECONDARY-T-SENSOR_2: X1507.3 ; also sheet 10
SECONDARY-T-SENSOR_3: X1507.4 ; also sheet 10
SECONDARY-T-SENSOR_4: X1507.5 ; also sheet 10
SECONDARY-T-SENSOR_5: X1507.6 ; also sheet 10
SECONDARY-T-SENSOR_6: X1507.7 ; also sheet 10
SECONDARY-T-SENSOR_7: X1507.8 ; also sheet 10
SECONDARY-TEMP-ALERT: X1508.18 ; also sheet 14
SECONDARY-WDT: X1508.16 ; also sheet 3
VBAT+: X1503.8 ; also sheet 4
VBAT-: X1503.1 ; also sheet 4
Unconnected: X1503.9 X1503.10 X1503.11 X1503.12 X1503.20 X1503.21 X1503.22 X1503.23 X1503.24

### Notes on the sheet
- Batterie Cell Voltage Sense Connector | Temperature Sensor Connector | Daisy Chain Connectors
- 24p connector equal for 12/15/18/20 cell version | 2x 16p connector equal for 12/15/18/20 cell version | 4x 2p connector equal for 12/15/18/20 cell version
- Primary Daisy-Chain
- Secondary Daisy-Chain
- Pin-Header for additional analog and digital inputs/outputs | GPIO Extension Connector | External Power Supply
- Connectors